# Altium project 110-0002.PrjPcb
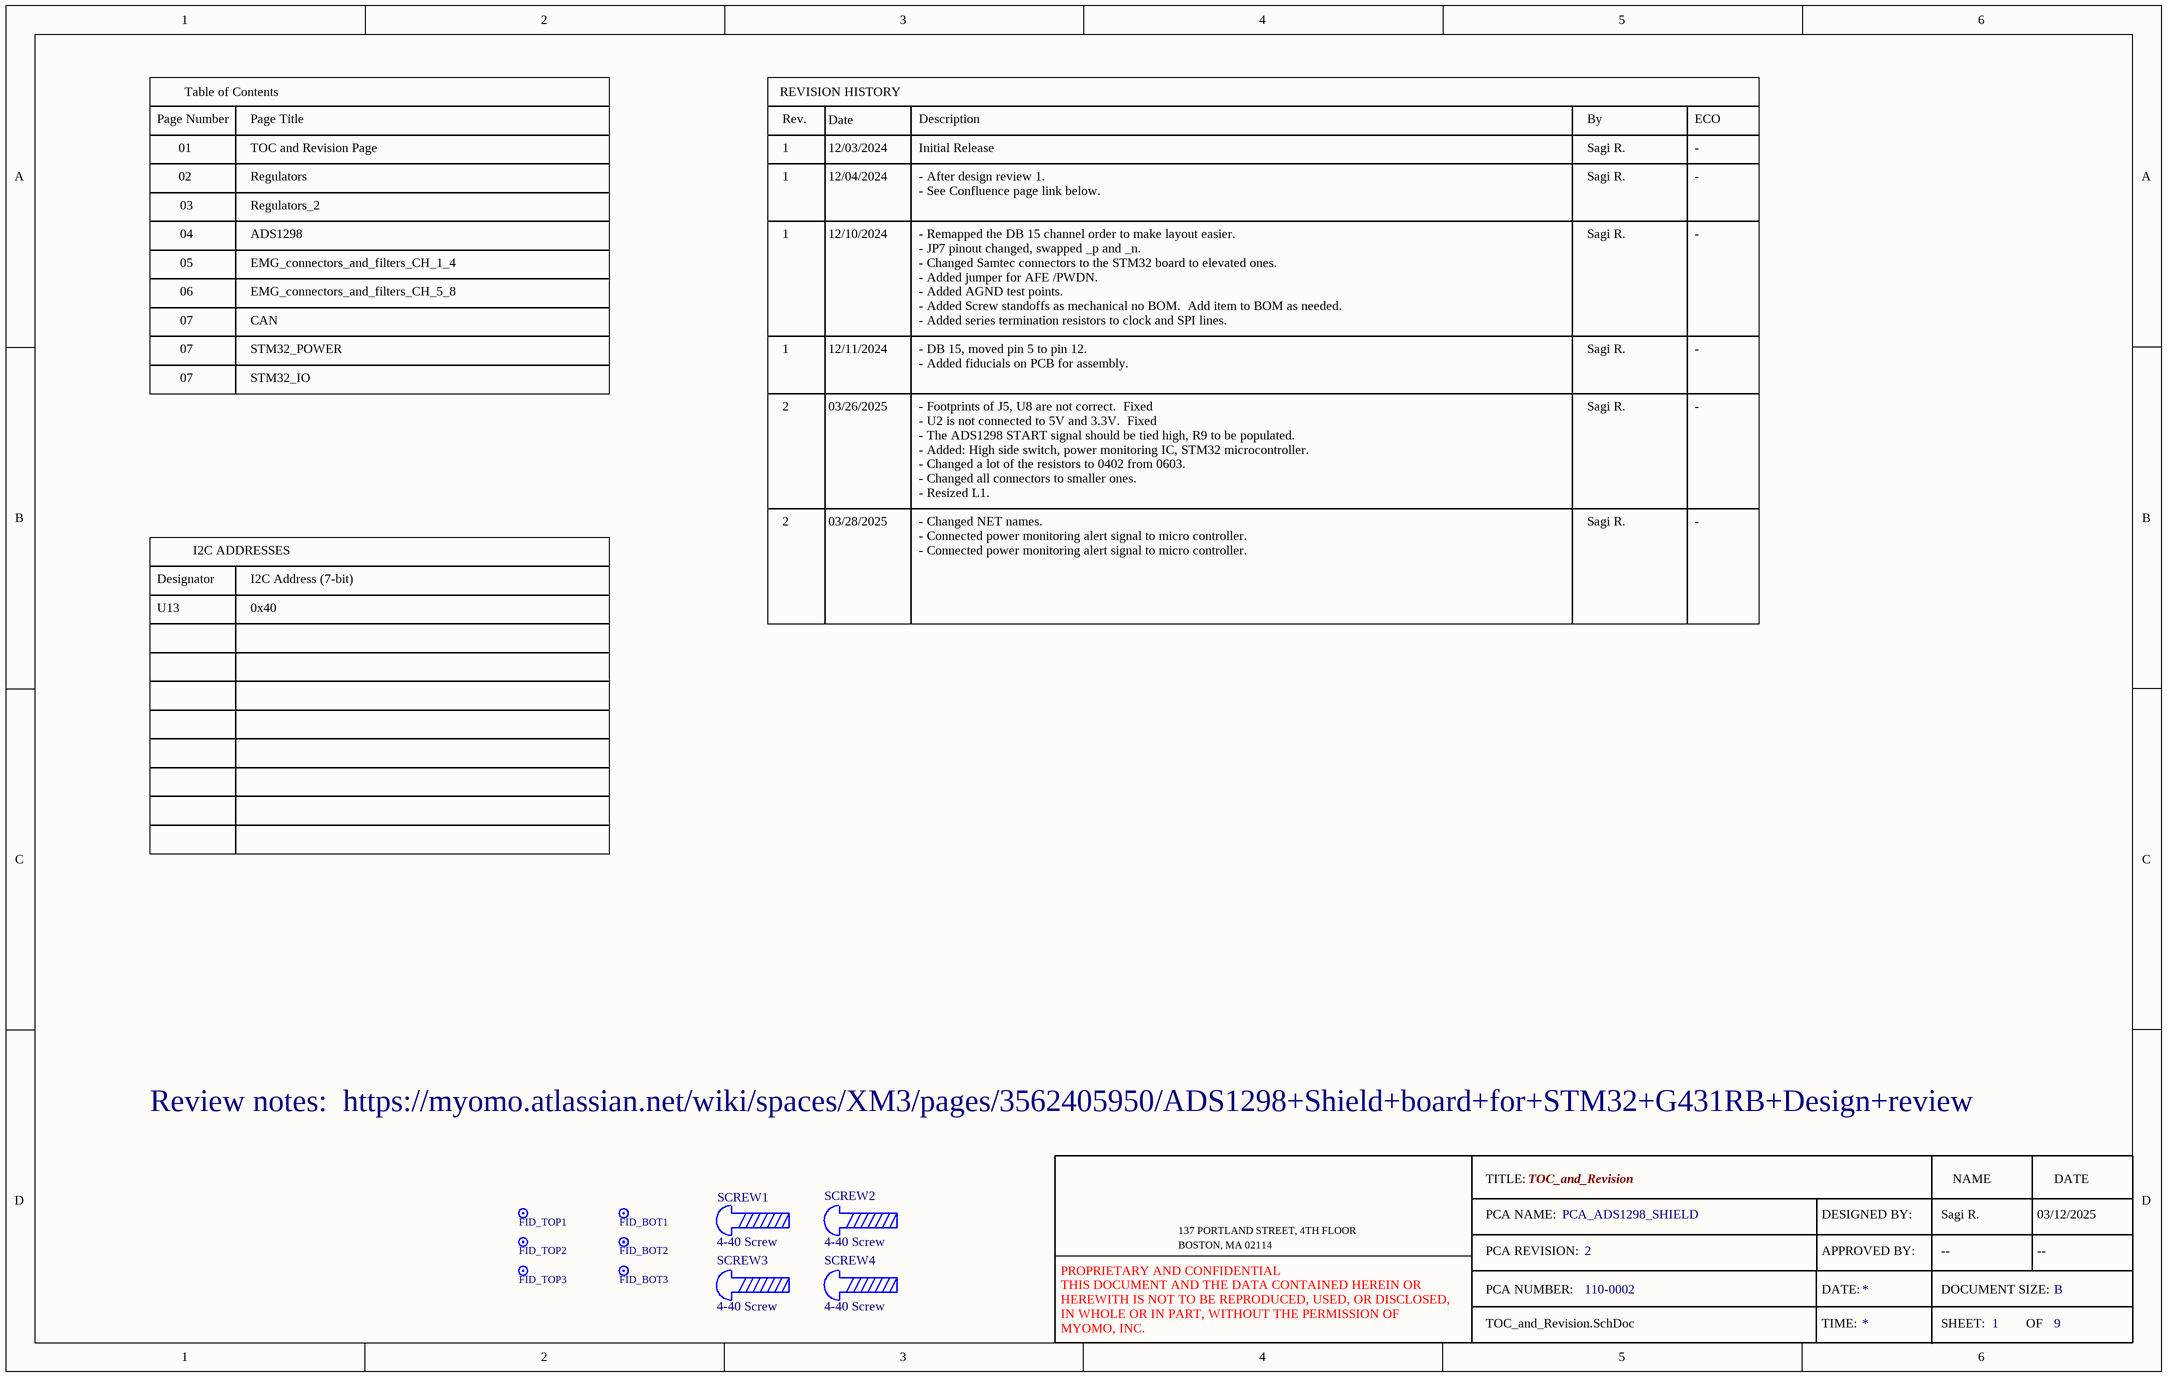
[diagram p0: TOC_and_Revision.SchDoc]
Address1: 45 Blue Sky Dr, Suite 101; Address2: Burlington, MA 01803-2778; Address3: USA; ApprovedBy: --; ApprovedDate: --; DesignDate: 03/12/2025; Engineer: Sagi R.; Organization: Myomo; PCA_Name: PCA_ADS1298_SHIELD; PCA_Number: 110-0002; PCA_Revision: 2; PCB_Name: PCB_ADS1298_SHIELD; PCB_Number: 100-0002; PCB_Revision: 2; PCBApprovedBy: --; PCBApprovedDate: --; SheetTotal: 9
9 sheets, 398 parts. Net scope: global (net labels, ports and power ports of the same name join across sheets).
Board file: 100-0002.PcbDoc
Sheets:
  TOC_and_Revision.SchDoc
  Regulators.SchDoc
  Regulators_2.SchDoc
  ADS1298.SchDoc
  EMG_connectors_and_filters_CH_1_4.SchDoc
  EMG_connectors_and_filters_CH_5_8.SchDoc
  CAN.SchDoc
  STM32_POWER.SchDoc
  STM32_IO.SchDoc

## Sheet TOC_and_Revision.SchDoc: TOC_and_Revision
size B; Organization: Myomo; Address1: 137 PORTLAND STREET, 4TH FLOOR; Address2: BOSTON, MA 02114; Address3: USA; SheetNumber: 1

### Parts
FID_BOT1  FID_BOT  [Fiducial_Bot]  (value not drawn)  (no BOM)
FID_BOT2  FID_BOT  [Fiducial_Bot]  (value not drawn)  (no BOM)
FID_BOT3  FID_BOT  [Fiducial_Bot]  (value not drawn)  (no BOM)
FID_TOP1  FID_TOP  [Fiducial_Top]  (value not drawn)  (no BOM)
FID_TOP2  FID_TOP  [Fiducial_Top]  (value not drawn)  (no BOM)
FID_TOP3  FID_TOP  [Fiducial_Top]  (value not drawn)  (no BOM)
SCREW1  4-40 Screw  [SCREW_4-40_STANDOFF]  (no BOM)
SCREW2  4-40 Screw  [SCREW_4-40_STANDOFF]  (no BOM)
SCREW3  4-40 Screw  [SCREW_4-40_STANDOFF]  (no BOM)
SCREW4  4-40 Screw  [SCREW_4-40_STANDOFF]  (no BOM)

### Notes on the sheet
- Table of Contents
- REVISION HISTORY
- Page Number
- 01
- Page Title
- TOC and Revision Page
- Rev.
- 1
- Date
- 12/03/2024
- Description
- Initial Release
- By
- Sagi R.
- ECO
- -
- 02
- 03
- 04
- Regulators
- ADS1298
- Regulators_2
- 12/04/2024
- 12/10/2024
- - After design review 1.
- - See Confluence page link below.
- - Remapped the DB 15 channel order to make layout easier.
- - JP7 pinout changed, swapped _p and _n.
- 05
- 06
- EMG_connectors_and_filters_CH_1_4
- EMG_connectors_and_filters_CH_5_8
- - Changed Samtec connectors to the STM32 board to elevated ones.
- - Added jumper for AFE /PWDN.
- - Added AGND test points.
- - Added Screw standoffs as mechanical no BOM.  Add item to BOM as needed.
- 07
- CAN
- STM32_IO
- STM32_POWER
- 12/11/2024
- - Added series termination resistors to clock and SPI lines.
- - DB 15, moved pin 5 to pin 12.
- - Added fiducials on PCB for assembly.
- 2
- 03/26/2025
- - Footprints of J5, U8 are not correct.  Fixed
- - U2 is not connected to 5V and 3.3V.  Fixed
- - The ADS1298 START signal should be tied high, R9 to be populated.
- - Added: High side switch, power monitoring IC, STM32 microcontroller.
- 03/28/2025
- - Changed a lot of the resistors to 0402 from 0603.
- - Changed all connectors to smaller ones.
- - Resized L1.
- - Changed NET names.
- - Connected power monitoring alert signal to micro controller.
- Designator
- I2C ADDRESSES
- I2C Address (7-bit)
- U13
- 0x40
- Review notes:  https://myomo.atlassian.net/wiki/spaces/XM3/pages/3562405950/ADS1298+Shield+board+for+STM32+G431RB+Design+review
- TITLE:
- NAME
- DATE
- PCA REVISION:
- PCA NAME:
- APPROVED BY:
- DESIGNED BY:
- PCA NUMBER:
- DATE:
- TIME:
- DOCUMENT SIZE:
- SHEET:
- OF
- B
- PROPRIETARY AND CONFIDENTIAL
  THIS DOCUMENT AND THE DATA CONTAINED HEREIN OR HEREWITH IS NOT TO BE REPRODUCED, USED, OR DISCLOSED, IN WHOLE OR IN PART, WITHOUT THE PERMISSION OF
  MYOMO, INC.

### Library data of the parts
FID_BOT1-FID_BOT3 = FID_BOT: Fiducial
FID_TOP1-FID_TOP3 = FID_TOP: Fiducial
SCREW1-SCREW4 = SCREW_4-40_STANDOFF: 4-40 standoff; MFG: none; MFGPN: 4-40 Screw

## Sheet Regulators.SchDoc: Regulators
size B; Organization: Myomo; Address1: 137 PORTLAND STREET, 4TH FLOOR; Address2: BOSTON, MA 02114; Address3: USA; SheetNumber: 2
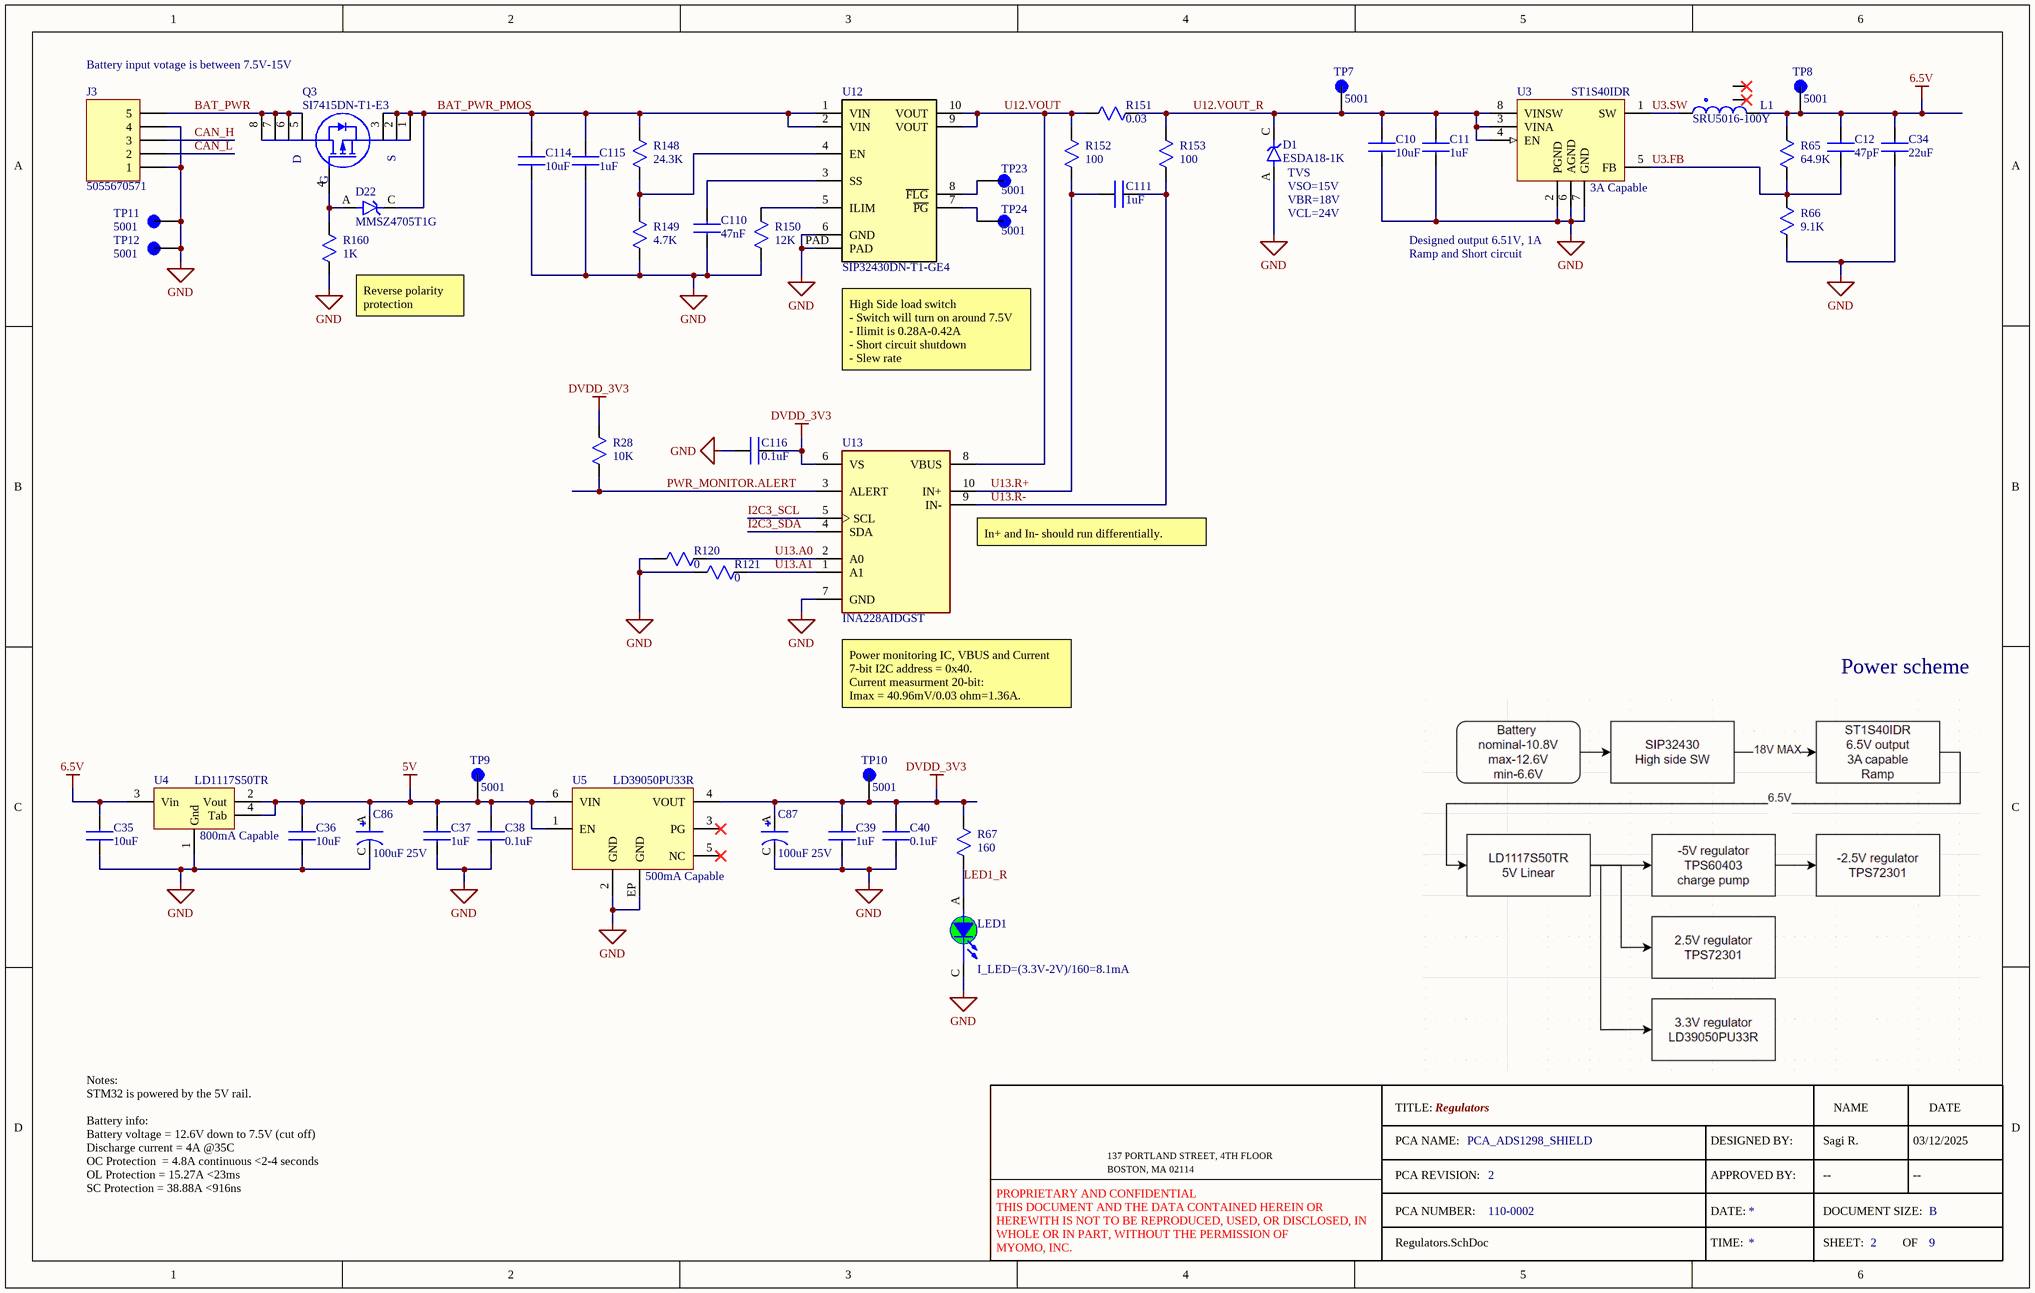
[diagram p1: Regulators.SchDoc]

### Parts
C10  10uF  [1210]
C11  1uF  [0603]
C12  47pF  [0603]
C34  22uF  [1210]
C35  10uF  [1210]
C36  10uF  [1210]
C37  1uF  [0603]
C38  0.1uF  [0402]
C39  1uF  [0603]
C40  0.1uF  [0402]
C86  100uF 25V  [C_2917_TANT_100uF_25V]
C87  100uF 25V  [C_2917_TANT_100uF_25V]
C110  47nF  [0402]
C111  1uF  [0603]
C114  10uF  [1210]
C115  1uF  [0603]
C116  0.1uF  [0402]
D1  ESDA18-1K  [D_TVS_18V_400W]
D22  MMSZ4705T1G  [D_ZENER_18V_500mW]
J3  5055670571  [J_MOLEX_5055670571]
L1  SRU5016-100Y  [L_10UH_84m_1A]
LED1  D_LED_GREEN_LTST  [D_LED_GREEN_LTST]  (value not drawn)
Q3  SI7415DN-T1-E3  [Q_PMOSFET_SI7415DN-T1-E3]
R28  10K  [0402]
R65  64.9K  [0603]
R66  9.1K  [0603]
R67  160  [0603]
R120  0  [0402]
R121  0  [0402]
R148  24.3K  [0402]
R149  4.7K  [0402]
R150  12K  [0402]
R151  0.03  [1206]
R152  100  [0402]
R153  100  [0402]
R160  1K  [0603]
TP7  5001  [TP_CLIP_BLK_5001]
TP8  5001  [TP_CLIP_BLK_5001]
TP9  5001  [TP_CLIP_BLK_5001]
TP10  5001  [TP_CLIP_BLK_5001]
TP11  5001  [TP_CLIP_BLK_5001]
TP12  5001  [TP_CLIP_BLK_5001]
TP23  5001  [TP_CLIP_BLK_5001]
TP24  5001  [TP_CLIP_BLK_5001]
U3  ST1S40IDR  [U_ST1S40IDR]
U4  LD1117S50TR  [U_LD1117S50TR]
U5  LD39050PU33R  [U_LD39050PU33R]
U12  SIP32430DN-T1-GE4  [U_SIP32430DN-T1-GE4]
U13  INA228AIDGST  [U_INA228AIDGS]

### Nets
5V: C36.1 C37.1 C38.1 C86.A TP9.TP U4.2(Vout) U4.4(Tab) U5.1(EN) U5.6(VIN)
6.5V: C12.1 C34.1 C35.1 L1.2 R65.1 TP8.TP U4.3(Vin)
DVDD_3V3: C39.1 C40.1 C87.A C116.2 R28.1 R67.1 TP10.TP U5.4(VOUT) U13.6(VS)
GND: C10.2 C11.2 C34.2 C35.2 C36.2 C37.2 C38.2 C39.2 C40.2 C86.C C87.C C110.2 C114.2 C115.2 C116.1 D1.A J3.1 J3.4 LED1.C(CATHODE) R66.2 R120.1 R121.1 R149.2 R150.2 R160.2 TP11.TP TP12.TP U3.2(PGND) U3.6(AGND) U3.7(GND) U4.1(Gnd) U5.2(GND) U5.EP(GND) U12.6(GND) U12.PAD U13.7(GND)
BAT_PWR: J3.5 Q3.5(D) Q3.6(D) Q3.7(D) Q3.8(D)
BAT_PWR_PMOS: C114.1 C115.1 D22.C Q3.1(S) Q3.2(S) Q3.3(S) R148.1 U12.1(VIN) U12.2(VIN)
CAN_H: J3.3
CAN_L: J3.2
I2C3_SCL: U13.5(SCL)
I2C3_SDA: U13.4(SDA)
LED1_R: LED1.A(ANODE) R67.2
PWR_MONITOR.ALERT: R28.2 U13.3(ALERT)
U3.FB: C12.2 R65.2 R66.1 U3.5(FB)
U3.SW: L1.1 U3.1(SW)
U12.VOUT: R151.1 R152.1 U12.9(VOUT) U12.10(VOUT) U13.8(VBUS)
U12.VOUT_R: C10.1 C11.1 D1.C R151.2 R153.1 TP7.TP U3.3(VINA) U3.4(EN) U3.8(VINSW)
U13.A0: R120.2 U13.2(A0)
U13.A1: R121.2 U13.1(A1)
U13.R+: C111.1 R152.2 U13.10(IN+)
U13.R-: C111.2 R153.2 U13.9(IN-)
NetC110_1: C110.1 U12.3(SS)
NetD22_A: D22.A Q3.4(G) R160.1
NetR148_2: R148.2 R149.1 U12.4(EN)
NetR150_1: R150.1 U12.5(ILIM)
NetTP23_TP: TP23.TP U12.8(~{FLG})
NetTP24_TP: TP24.TP U12.7(~{PG})

Not connected (* = marked no-connect by the designer): L1 MH1* MH2*; U5 3(PG)* 5(NC)*

### Notes on the sheet
- (near J3) Battery input votage is between 7.5V-15V
- (near D1) VBR=18V
- (near D1) VSO=15V
- (near D1) VCL=24V
- (near D1) TVS
- (near U3) 3A Capable
- Designed output 6.51V, 1A
- Ramp and Short circuit
- (near R160) Reverse polarity protection
- (near U12) High Side load switch
  - Switch will turn on around 7.5V
  - Ilimit is 0.28A-0.42A
  - Short circuit shutdown
  - Slew rate
- (near U13) In+ and In- should run differentially.
- (near U13) Power monitoring IC, VBUS and Current
  7-bit I2C address = 0x40.
  Current measurment 20-bit:
  Imax = 40.96mV/0.03 ohm=1.36A.
- Power scheme
- (near U4) 800mA Capable
- (near U5) 500mA Capable
- (near LED1) I_LED=(3.3V-2V)/160=8.1mA
- Notes:
  STM32 is powered by the 5V rail.
  Battery info:
  Battery voltage = 12.6V down to 7.5V (cut off)
  Discharge current = 4A @35C
  OC Protection  = 4.8A continuous <2-4 seconds
  OL Protection = 15.27A <23ms
  SC Protection = 38.88A <916ns
- TITLE:
- NAME
- DATE
- PCA REVISION:
- PCA NAME:
- APPROVED BY:
- DESIGNED BY:
- PCA NUMBER:
- DATE:
- TIME:
- DOCUMENT SIZE:
- SHEET:
- OF
- B
- PROPRIETARY AND CONFIDENTIAL
  THIS DOCUMENT AND THE DATA CONTAINED HEREIN OR HEREWITH IS NOT TO BE REPRODUCED, USED, OR DISCLOSED, IN WHOLE OR IN PART, WITHOUT THE PERMISSION OF
  MYOMO, INC.

### Library data of the parts
C10 C35 C36 C114 = C_1210_CER_10uF_25V_X7R: CAP CER 10UF 25V X7R 1210; MFG: SUMSUNG; MFGPN: CL32B106KAJNNNE; Myomo PN: 201-0004
C11 C37 C39 C111 C115 = C_0603_CER_1uF_50V_X7R: CAP CER 1UF 50V X7R 0603; MFG: YAGEO; MFGPN: CC0603KRX7R9BB105; Myomo PN: 201-0006
C12 = C_0603_CER_47pF_100V_COG: CAP CER 47PF 100V C0G/NP0 0603; MFG: KEMET; MFGPN: C0603C470J1GACTU; Myomo PN: 201-0011
C34 = C_1210_CER_22uF_25V_X7R: CAP CER 22UF 25V X7R 1210; MFG: SUMSUNG; MFGPN: CL32B226KAJNFNE; Myomo PN: 201-0007
C38 C40 C116 = C_0402_CER_0.1uF_50V_X7R: CAP CER 0.1UF 50V X7R 0402; MFG: Samsung; MFGPN: CL05B104KB54PNC; Myomo PN: 201-0017
C86 C87 = C_2917_TANT_100uF_25V: CAP TANT POLY 100UF 25V 2917; MFG: AVX Corporation; MFGPN: TCJD107M025R0070; Myomo PN: 201-0014
C110 = C_0402_CER_47nF_50V_X7R: CAP CER 47nF 50V X7R 0402; MFG: TDK; MFGPN: CGA2B3X7R1H473K050BB; Myomo PN: 201-0018
D1 = D_TVS_18V_400W: TVS DIODE 15VWM 34VC SOD523; MFG: STMicroelectronics; Myomo PN: 203-0003; MFGPN: ESDA18-1K
D22 = D_ZENER_18V_500mW: DIODE ZENER 18V 500MW SOD123; MFG: Onsemi; Myomo PN: 203-0008; MFGPN: MMSZ4705T1G
J3 = J_MOLEX_5055670571: CONN HEADER SMD R/A 5POS 1.25MM; MFG: Molex; Myomo PN: 211-0012; MFGPN: 5055670571; ComponentLink1Description: New link; ComponentLink1URL: *
L1 = L_10UH_84m_1A: FIXED IND 10UH 1A 84 MOHM SMD; MFG: Bourns Inc.; Myomo PN: 202-0003; MFGPN: SRU5016-100Y
LED1 = D_LED_GREEN_LTST: LED GREEN CLEAR 0603 SMD; Myomo PN: 203-0004; MFG: Lite-On Inc.; MFGPN: LTST-C191KGKT; Supplier 1: Digi-Key; Supplier Part Number 1: 160-1446-1-ND
Q3 = Q_PMOSFET_SI7415DN-T1-E3: MOSFET P-CH 60V 3.6A PPAK1212-8; MFG: Vishay; Myomo PN: 208-0002; Supplier 1: Digi-Key; MFGPN: SI7415DN-T1-E3; Supplier Part Number 1: MMUN2211LT1GOSCT-ND
R28 = R_0402_10K_1%_1/10W: RES SMD 10K OHM 1% 1/10W 0402; MFG: Panasonic; MFGPN: ERJ-2RKF1002X; Myomo PN: 200-0021
R65 = R_0603_64.9K_1%_1/10W: RES 64.9K OHM 1% 1/10W 0603; MFG: YAGEO; MFGPN: RC0603FR-0764K9L; Myomo PN: 200-0011
R66 = R_0603_9.1K_1%_1/10W: RES 9.1K OHM 1% 1/10W 0603; MFG: YAGEO; MFGPN: RC0603FR-079K1L; Myomo PN: 200-0010
R67 = R_0603_160_1%_1/10W: RES 160 OHM 1% 1/10W 0603; MFG: YAGEO; MFGPN: RC0603FR-07160RL; Myomo PN: 200-0012
R120 R121 = R_0402_0: RES 0 OHM JUMPER 1/10W 0402; MFG: YAGEO; MFGPN: RC0402FR-070RL; Myomo PN: 200-0018
R148 = R_0402_24.3K_1%_1/10W: RES SMD 24.3K OHM 1% 1/10W 0402; MFG: Panasonic; MFGPN: ERJ-2RKF2432X; Myomo PN: 200-0023
R149 = R_0402_4.7K_1%_1/10W: RES SMD 4.7K OHM 1% 1/10W 0402; MFG: Panasonic; MFGPN: ERJ-2RKF4701X; Myomo PN: 200-0022
R150 = R_0402_12K_1%_1/10W: RES SMD 12K OHM 1% 1/10W 0402; MFG: Panasonic; MFGPN: ERJ-2RKF1202X; Myomo PN: 200-0021
R151 = R_1206_0.03_0.5%_1W: RES 0.03 OHM 0.5% 1W 1206; MFG: Vishay; MFGPN: WSLP1206R0300DEA; Myomo PN: 200-0025
R152 R153 = R_0402_100_1%_1/10W: RES SMD 100 OHM 1% 1/10W 0402; MFG: Panasonic; MFGPN: ERJ-2RKF1000X; Myomo PN: 200-0019
R160 = R_0603_1K_1%_1/10W: RES 1K OHM 1% 1/10W 0603; MFG: YAGEO; MFGPN: RC0603FR-071KL; Myomo PN: 200-0029
TP7-TP12 TP23 TP24 = TP_CLIP_BLK_5001: PC TEST POINT MINIATURE BLACK; MFG: Keystone Electronics; Myomo PN: 213-0001; MFGPN: 5001
U3 = U_ST1S40IDR: IC REG BUCK ADJ 3A 8SOIC; MFG: STMicroelectronics; Myomo PN: 204-0004; MFGPN: ST1S40IDR; Supplier 1: Digikey; Supplier Part Number 1: 497-12968-1-ND
U4 = U_LD1117S50TR: IC REG LINEAR 5V 800MA SOT223; MFG: STMICROELECTRONICS; Myomo PN: 204-0006; MFGPN: LD1117S50TR; ComponentLink1Description: Datasheet; ComponentLink1URL: http://tunmcdsvn.tun.st.com/Component_Datasheet_Library/Trunk/IC/STM_LDO_LD1117
U5 = U_LD39050PU33R: IC REG LINEAR 3.3V 500MA 6DFN; MFG: STMICROELECTRONICS; Myomo PN: 204-0005; MFGPN: LD39050PU33R; ComponentLink1Description: Datasheet; ComponentLink1URL: http://tunmcdsvn.tun.st.com/Component_Datasheet_Library/Trunk/IC/STM_LDO_LD1117
U12 = U_SIP32430DN-T1-GE4: HIGH SIDE SWITCH - IC PWR SWITCH P-CHAN 1:1 10DFN; MFG: Vishay; Myomo PN: 204-0013; MFGPN: SIP32430DN-T1-GE4
U13 = U_INA228AIDGS: IC REG BUCK ADJ 3A 8SOIC; MFG: TI; Myomo PN: 204-0014; MFGPN: INA228AIDGST; Supplier 1: Digikey; Supplier Part Number 1: 296-INA228AIDGSTDKR-ND

## Sheet Regulators_2.SchDoc: Regulators_2
size B; Organization: Myomo; Address1: 137 PORTLAND STREET, 4TH FLOOR; Address2: BOSTON, MA 02114; Address3: USA; SheetNumber: 3
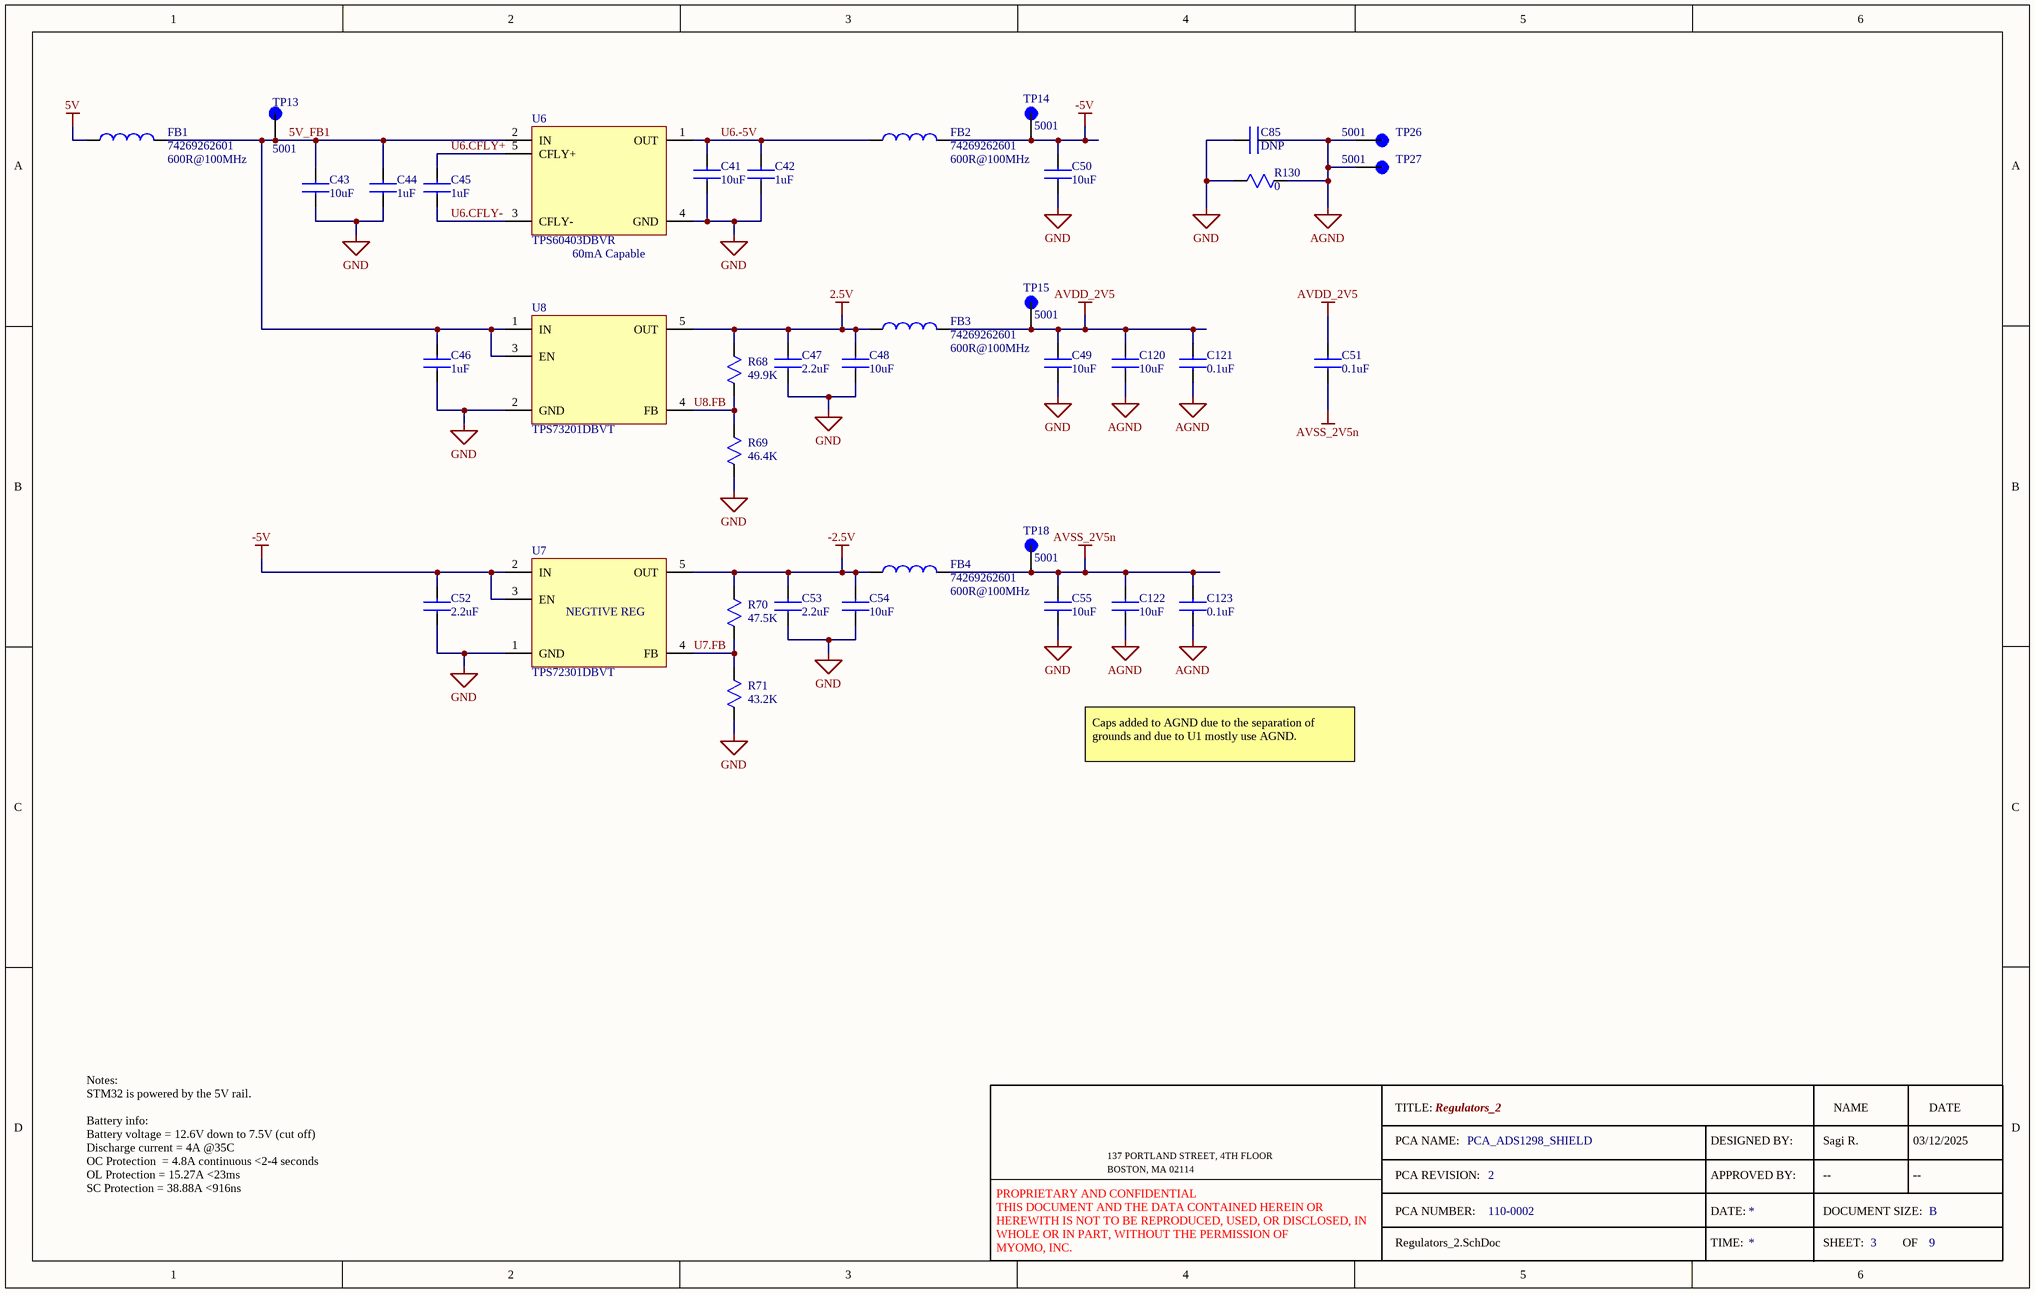
[diagram p2: Regulators_2.SchDoc]

### Parts
C41  10uF  [1210]
C42  1uF  [0603]
C43  10uF  [1210]
C44  1uF  [0603]
C45  1uF  [0603]
C46  1uF  [0603]
C47  2.2uF  [0603]
C48  10uF  [1210]
C49  10uF  [1210]
C50  10uF  [1210]
C51  0.1uF  [0603]
C52  2.2uF  [0603]
C53  2.2uF  [0603]
C54  10uF  [1210]
C55  10uF  [1210]
C85  DNP  [0603]  (no BOM)
C120  10uF  [1210]
C121  0.1uF  [0603]
C122  10uF  [1210]
C123  0.1uF  [0603]
FB1  74269262601  [0603]
FB2  74269262601  [0603]
FB3  74269262601  [0603]
FB4  74269262601  [0603]
R68  49.9K  [0603]
R69  46.4K  [0603]
R70  47.5K  [0603]
R71  43.2K  [0603]
R130  0  [0603]
TP13  5001  [TP_CLIP_BLK_5001]
TP14  5001  [TP_CLIP_BLK_5001]
TP15  5001  [TP_CLIP_BLK_5001]
TP18  5001  [TP_CLIP_BLK_5001]
TP26  5001  [TP_CLIP_BLK_5001]
TP27  5001  [TP_CLIP_BLK_5001]
U6  TPS60403DBVR  [U_TPS60403DBVR]
U7  TPS72301DBVT  [U_TPS72301DBVT_NEG]
U8  TPS73201DBVT  [U_TPS73201DBVT]

### Nets
2.5V: C47.1 C48.1 FB3.1 R68.1 U8.5(OUT)
5V: FB1.1
-2.5V: C53.1 C54.1 FB4.1 R70.1 U7.5(OUT)
-5V: C50.1 C52.1 FB2.2 TP14.TP U7.2(IN) U7.3(EN)
AGND: C85.2 C120.2 C121.2 C122.2 C123.2 R130.2 TP26.TP TP27.TP
AVDD_2V5: C49.1 C51.1 C120.1 C121.1 FB3.2 TP15.TP
AVSS_2V5n: C51.2 C55.1 C122.1 C123.1 FB4.2 TP18.TP
GND: C41.2 C42.2 C43.2 C44.2 C46.2 C47.2 C48.2 C49.2 C50.2 C52.2 C53.2 C54.2 C55.2 C85.1 R69.2 R71.2 R130.1 U6.4(GND) U7.1(GND) U8.2(GND)
5V_FB1: C43.1 C44.1 C46.1 FB1.2 TP13.TP U6.2(IN) U8.1(IN) U8.3(EN)
U6.-5V: C41.1 C42.1 FB2.1 U6.1(OUT)
U6.CFLY+: C45.1 U6.5(CFLY+)
U6.CFLY-: C45.2 U6.3(CFLY-)
U7.FB: R70.2 R71.1 U7.4(FB)
U8.FB: R68.2 R69.1 U8.4(FB)

### Notes on the sheet
- (near U6) 60mA Capable
- Caps added to AGND due to the separation of grounds and due to U1 mostly use AGND.
- Notes:
  STM32 is powered by the 5V rail.
  Battery info:
  Battery voltage = 12.6V down to 7.5V (cut off)
  Discharge current = 4A @35C
  OC Protection  = 4.8A continuous <2-4 seconds
  OL Protection = 15.27A <23ms
  SC Protection = 38.88A <916ns
- TITLE:
- NAME
- DATE
- PCA REVISION:
- PCA NAME:
- APPROVED BY:
- DESIGNED BY:
- PCA NUMBER:
- DATE:
- TIME:
- DOCUMENT SIZE:
- SHEET:
- OF
- B
- PROPRIETARY AND CONFIDENTIAL
  THIS DOCUMENT AND THE DATA CONTAINED HEREIN OR HEREWITH IS NOT TO BE REPRODUCED, USED, OR DISCLOSED, IN WHOLE OR IN PART, WITHOUT THE PERMISSION OF
  MYOMO, INC.
- (in symbol FB_0603 _600_100MHz_1.5A) 600R@100MHz
- (in symbol U_TPS72301DBVT_NEG) NEGTIVE REG

### Library data of the parts
C41 C43 C48-C50 C54 C55 C120 C122 = C_1210_CER_10uF_25V_X7R: as C10 on sheet Regulators
C42 C44-C46 = C_0603_CER_1uF_50V_X7R: as C11 on sheet Regulators
C47 C52 C53 = C_0603_CER_2.2uF_50V_X5R: CAP CER 2.2UF 50V X5R 0603; MFG: SAMSUNG; MFGPN: CL10A225KB8NNNC; Myomo PN: 201-0012
C51 C121 C123 = C_0603_CER_0.1uF_100V_X7R: CAP CER 0.1UF 100V X7R 0603; MFG: SAMSUNG; MFGPN: CL10B104KC8NNNC; Myomo PN: 201-0005
C85 = C_0603_DNP: CAP CER 0603 DNP
FB1-FB4 = FB_0603 _600_100MHz_1.5A: 600 Ohms @ 100 MHz 1 Power Line Ferrite Bead 0603 (1608 Metric) 1.5A 100mOhm; MFG: Wurth Elektronik; Myomo PN: 202-0001; MFGPN: 74269262601
R68 = R_0603_49.9K_1%_1/10W: RES 49.9K OHM 1% 1/10W 0603; MFG: YAGEO; MFGPN: RC0603FR-0749K9L; Myomo PN: 200-0009
R69 = R_0603_46.4K_1%_1/10W: RES 46.4K OHM 1% 1/10W 0603; MFG: YAGEO; MFGPN: RC0603FR-0746K4L; Myomo PN: 200-0013
R70 = R_0603_47.5K_1%_1/10W: RES 47.5K OHM 1% 1/10W 0603; MFG: YAGEO; MFGPN: RC0603FR-0747K5L; Myomo PN: 200-0014
R71 = R_0603_43.2K_1%_1/10W: RES 43.2K OHM 1% 1/10W 0603; MFG: YAGEO; MFGPN: RC0603FR-1343K2L; Myomo PN: 200-0015
R130 = R_0603_0: RES 0 OHM JUMPER 1/10W 0603; MFG: YAGEO; MFGPN: RC0603FR-070RL; Myomo PN: 200-0007
TP13-TP15 TP18 TP26 TP27 = TP_CLIP_BLK_5001: as TP7 on sheet Regulators; MFGPN: 5001
U6 = U_TPS60403DBVR: IC REG CHG PUMP INV 60MA SOT23-5; MFG: TI; Myomo PN: 204-0007; MFGPN: TPS60403DBVR
U7 = U_TPS72301DBVT_NEG: IC REG LIN NEG ADJ 200MA SOT23-5; MFG: TI; Myomo PN: 204-0008; MFGPN: TPS72301DBVT
U8 = U_TPS73201DBVT: IC REG LIN POS ADJ 250MA SOT23-5; MFG: TI; Myomo PN: 204-0009; MFGPN: TPS73201DBVT

## Sheet ADS1298.SchDoc: ADS1298
size B; Organization: Myomo; Address1: 137 PORTLAND STREET, 4TH FLOOR; Address2: BOSTON, MA 02114; Address3: USA; SheetNumber: 4
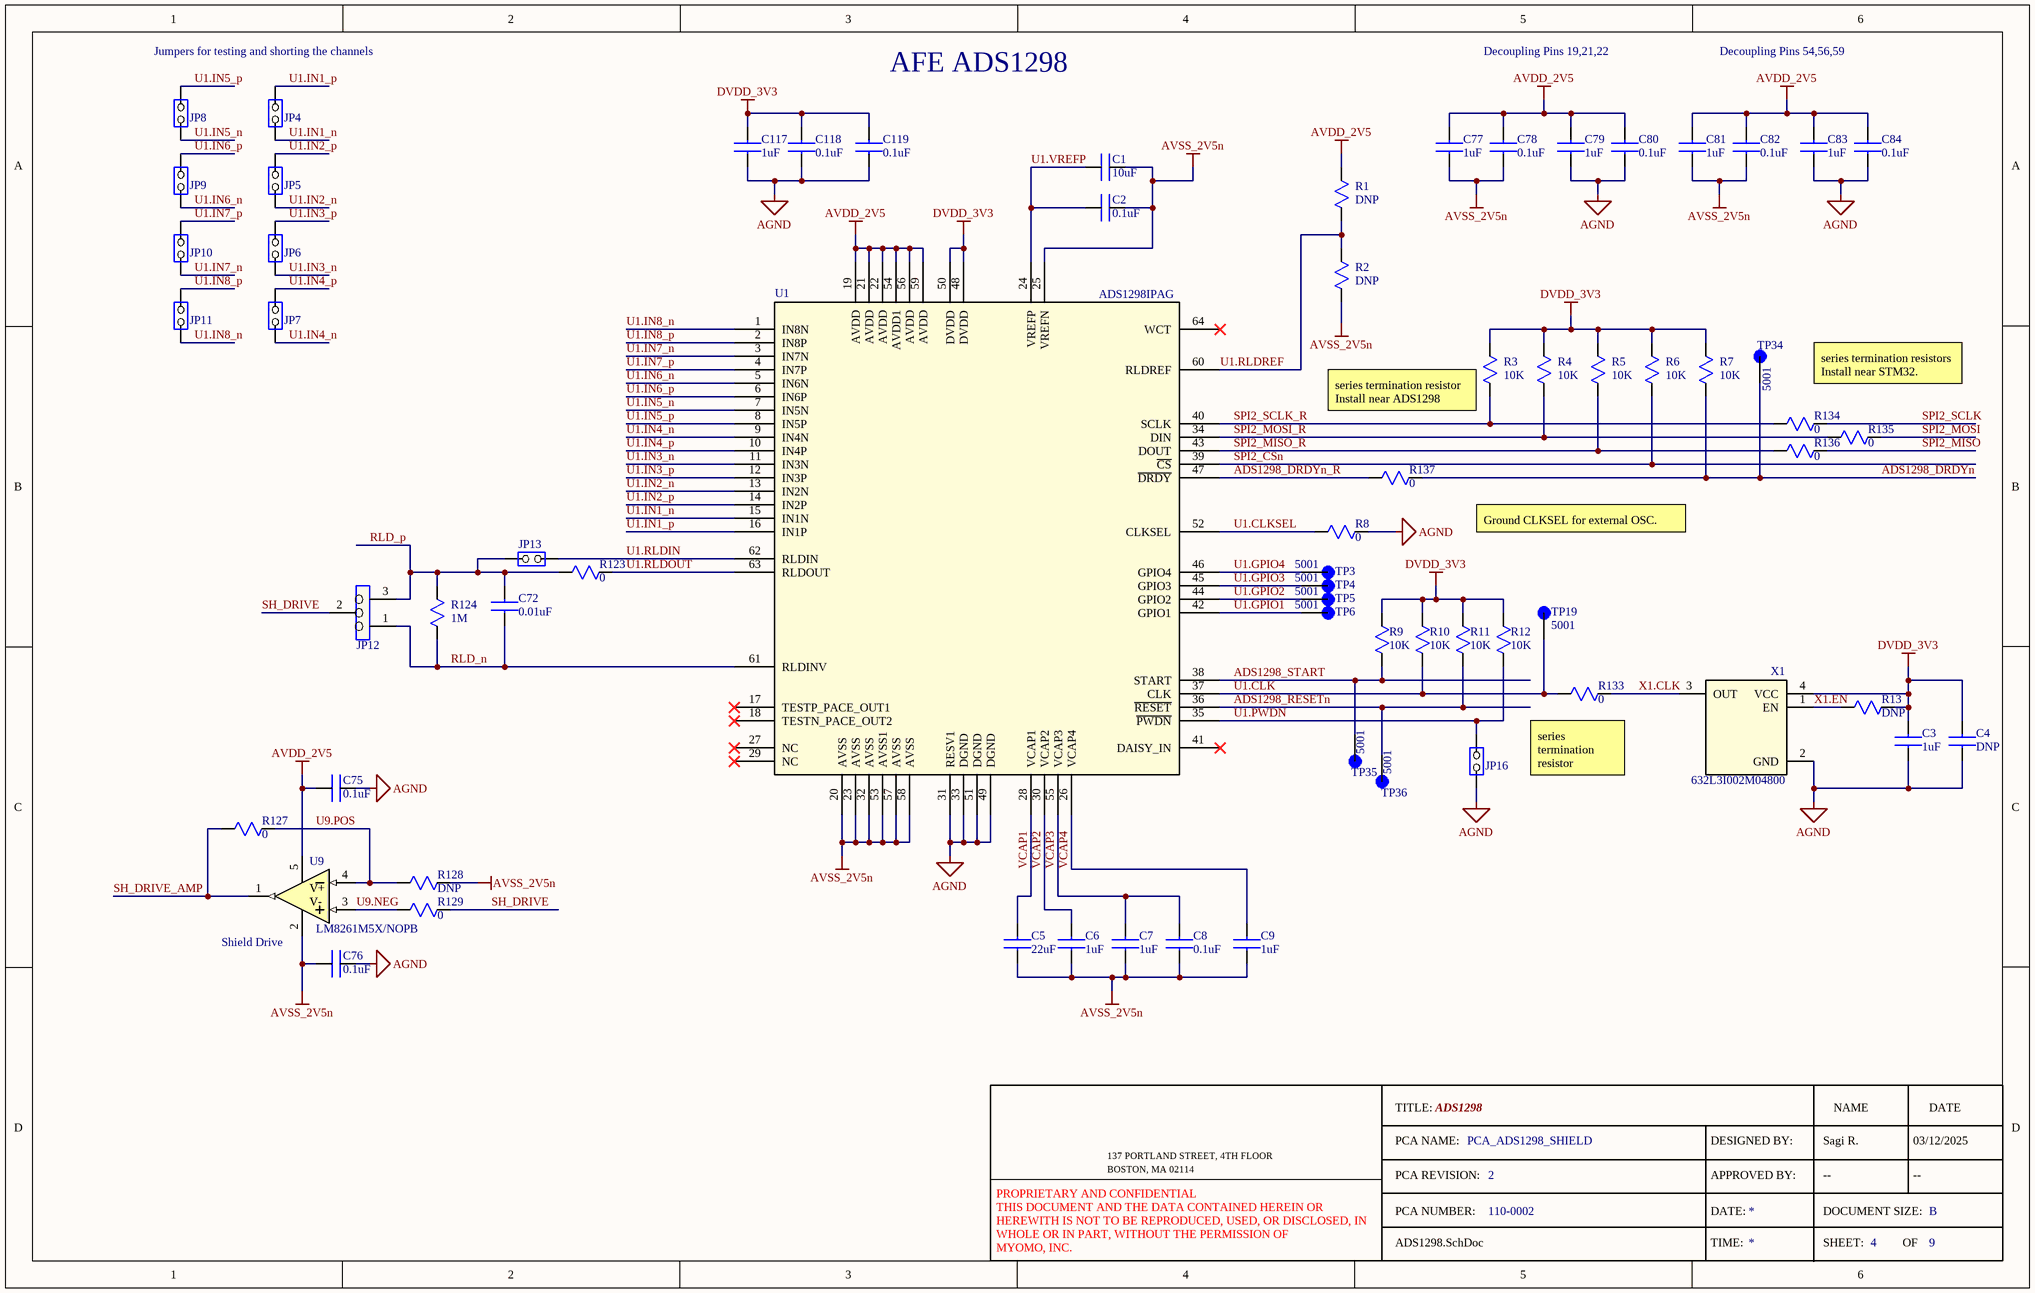
[diagram p3: ADS1298.SchDoc]

### Parts
C1  10uF  [1210]
C2  0.1uF  [0402]
C3  1uF  [0603]
C4  DNP  [0603]  (no BOM)
C5  22uF  [1210]
C6  1uF  [0603]
C7  1uF  [0603]
C8  0.1uF  [0402]
C9  1uF  [0603]
C72  0.01uF  [0603]
C75  0.1uF  [0402]
C76  0.1uF  [0402]
C77  1uF  [0603]
C78  0.1uF  [0402]
C79  1uF  [0603]
C80  0.1uF  [0402]
C81  1uF  [0603]
C82  0.1uF  [0402]
C83  1uF  [0603]
C84  0.1uF  [0402]
C117  1uF  [0603]
C118  0.1uF  [0402]
C119  0.1uF  [0402]
JP4  JP_1x2_TSW-102-07-F-S  [JP_1x2_TSW-102-07-F-S]  (value not drawn)
JP5  JP_1x2_TSW-102-07-F-S  [JP_1x2_TSW-102-07-F-S]  (value not drawn)
JP6  JP_1x2_TSW-102-07-F-S  [JP_1x2_TSW-102-07-F-S]  (value not drawn)
JP7  JP_1x2_TSW-102-07-F-S  [JP_1x2_TSW-102-07-F-S]  (value not drawn)
JP8  JP_1x2_TSW-102-07-F-S  [JP_1x2_TSW-102-07-F-S]  (value not drawn)
JP9  JP_1x2_TSW-102-07-F-S  [JP_1x2_TSW-102-07-F-S]  (value not drawn)
JP10  JP_1x2_TSW-102-07-F-S  [JP_1x2_TSW-102-07-F-S]  (value not drawn)
JP11  JP_1x2_TSW-102-07-F-S  [JP_1x2_TSW-102-07-F-S]  (value not drawn)
JP12  JP_1x3_TSW-103-07-F-S  [JP_1x3_TSW-103-07-F-S]  (value not drawn)
JP13  JP_1x2_TSW-102-07-F-S  [JP_1x2_TSW-102-07-F-S]  (value not drawn)
JP16  JP_1x2_TSW-102-07-F-S  [JP_1x2_TSW-102-07-F-S]  (value not drawn)
R1  DNP  [0402]  (no BOM)
R2  DNP  [0402]  (no BOM)
R3  10K  [0402]
R4  10K  [0402]
R5  10K  [0402]
R6  10K  [0402]
R7  10K  [0402]
R8  0  [0603]
R9  10K  [0402]
R10  10K  [0402]
R11  10K  [0402]
R12  10K  [0402]
R13  DNP  [0603]  (no BOM)
R123  0  [0603]
R124  1M  [0402]
R127  0  [0402]
R128  DNP  [0402]  (no BOM)
R129  0  [0402]
R133  0  [0603]
R134  0  [0402]
R135  0  [0402]
R136  0  [0402]
R137  0  [0603]
TP3  5001  [TP_CLIP_BLK_5001]
TP4  5001  [TP_CLIP_BLK_5001]
TP5  5001  [TP_CLIP_BLK_5001]
TP6  5001  [TP_CLIP_BLK_5001]
TP19  5001  [TP_CLIP_BLK_5001]
TP34  5001  [TP_CLIP_BLK_5001]
TP35  5001  [TP_CLIP_BLK_5001]
TP36  5001  [TP_CLIP_BLK_5001]
U1  ADS1298IPAG  [U_ADS1298IPAG]
U9  LM8261M5X/NOPB  [U_LM8261M5X/NOPB]
X1  632L3I002M04800  [XTAL_2.048MHZ_50PPM_3.3V]

### Nets
AGND: C3.2 C4.2 C75.2 C76.2 C79.2 C80.2 C83.2 C84.2 C117.2 C118.2 C119.2 JP16.1 R8.2 U1.31(RESV1) U1.33(DGND) U1.49(DGND) U1.51(DGND) X1.2(GND)
AVDD_2V5: C75.1 C77.1 C78.1 C79.1 C80.1 C81.1 C82.1 C83.1 C84.1 R1.1 U1.19(AVDD) U1.21(AVDD) U1.22(AVDD) U1.54(AVDD1) U1.56(AVDD) U1.59(AVDD) U9.5(V+)
AVSS_2V5n: C1.2 C2.2 C5.2 C6.2 C7.2 C8.2 C9.2 C76.1 C77.2 C78.2 C81.2 C82.2 R2.2 R128.2 U1.20(AVSS) U1.23(AVSS) U1.25(VREFN) U1.32(AVSS) U1.53(AVSS1) U1.57(AVSS) U1.58(AVSS) U9.2(V-)
DVDD_3V3: C3.1 C4.1 C117.1 C118.1 C119.1 R3.1 R4.1 R5.1 R6.1 R7.1 R9.1 R10.1 R11.1 R12.1 R13.2 U1.48(DVDD) U1.50(DVDD) X1.4(VCC)
ADS1298_DRDYn: R7.2 R137.2 TP34.TP
ADS1298_DRDYn_R: R137.1 U1.47(~{DRDY})
ADS1298_RESETn: R11.2 TP36.TP U1.36(~{RESET})
ADS1298_START: R9.2 TP35.TP U1.38(START)
RLD_n: C72.2 JP12.1 R124.2 U1.61(RLDINV)
RLD_p: C72.1 JP12.3 JP13.1 R123.1 R124.1
SH_DRIVE: JP12.2 R129.2
SH_DRIVE_AMP: R127.1 U9.1(OUT)
SPI2_CSn: R6.2 U1.39(~{CS})
SPI2_MISO: R136.2
SPI2_MISO_R: R5.2 R136.1 U1.43(DOUT)
SPI2_MOSI: R135.2
SPI2_MOSI_R: R4.2 R135.1 U1.34(DIN)
SPI2_SCLK: R134.2
SPI2_SCLK_R: R3.2 R134.1 U1.40(SCLK)
U1.CLK: R10.2 R133.1 TP19.TP U1.37(CLK)
U1.CLKSEL: R8.1 U1.52(CLKSEL)
U1.GPIO1: TP6.TP U1.42(GPIO1)
U1.GPIO2: TP5.TP U1.44(GPIO2)
U1.GPIO3: TP4.TP U1.45(GPIO3)
U1.GPIO4: TP3.TP U1.46(GPIO4)
U1.IN1_n: JP4.2 U1.15(IN1N)
U1.IN1_p: JP4.1 U1.16(IN1P)
U1.IN2_n: JP5.2 U1.13(IN2N)
U1.IN2_p: JP5.1 U1.14(IN2P)
U1.IN3_n: JP6.2 U1.11(IN3N)
U1.IN3_p: JP6.1 U1.12(IN3P)
U1.IN4_n: JP7.2 U1.9(IN4N)
U1.IN4_p: JP7.1 U1.10(IN4P)
U1.IN5_n: JP8.2 U1.7(IN5N)
U1.IN5_p: JP8.1 U1.8(IN5P)
U1.IN6_n: JP9.2 U1.5(IN6N)
U1.IN6_p: JP9.1 U1.6(IN6P)
U1.IN7_n: JP10.2 U1.3(IN7N)
U1.IN7_p: JP10.1 U1.4(IN7P)
U1.IN8_n: JP11.2 U1.1(IN8N)
U1.IN8_p: JP11.1 U1.2(IN8P)
U1.PWDN: JP16.2 R12.2 U1.35(~{PWDN})
U1.RLDIN: JP13.2 U1.62(RLDIN)
U1.RLDOUT: R123.2 U1.63(RLDOUT)
U1.RLDREF: R1.2 R2.1 U1.60(RLDREF)
U1.VREFP: C1.1 C2.1 U1.24(VREFP)
U9.NEG: R129.1 U9.3(IN+)
U9.POS: R127.2 R128.1 U9.4(IN-)
VCAP1: C5.1 U1.28(VCAP1)
VCAP2: C6.1 U1.30(VCAP2)
VCAP3: C7.1 C8.1 U1.55(VCAP3)
VCAP4: C9.1 U1.26(VCAP4)
X1.CLK: R133.2 X1.3(OUT)
X1.EN: R13.1 X1.1(EN)

Not connected (* = marked no-connect by the designer): U1 17(TESTP_PACE_OUT1)* 18(TESTN_PACE_OUT2)* 27(NC)* 29(NC)* 41(DAISY_IN)* 64(WCT)*

### Notes on the sheet
- Jumpers for testing and shorting the channels
- AFE ADS1298
- Decoupling Pins 19,21,22
- Decoupling Pins 54,56,59
- (near R3) series termination resistor
  Install near ADS1298
- series termination resistors
  Install near STM32.
- Ground CLKSEL for external OSC.
- (near R133) series termination resistor
- Shield Drive
- TITLE:
- NAME
- DATE
- PCA REVISION:
- PCA NAME:
- APPROVED BY:
- DESIGNED BY:
- PCA NUMBER:
- DATE:
- TIME:
- DOCUMENT SIZE:
- SHEET:
- OF
- B
- PROPRIETARY AND CONFIDENTIAL
  THIS DOCUMENT AND THE DATA CONTAINED HEREIN OR HEREWITH IS NOT TO BE REPRODUCED, USED, OR DISCLOSED, IN WHOLE OR IN PART, WITHOUT THE PERMISSION OF
  MYOMO, INC.

### Library data of the parts
C1 = C_1210_CER_10uF_25V_X7R: as C10 on sheet Regulators
C2 C8 C75 C76 C78 C80 C82 C84 C118 C119 = C_0402_CER_0.1uF_50V_X7R: as C38 on sheet Regulators
C3 C6 C7 C9 C77 C79 C81 C83 C117 = C_0603_CER_1uF_50V_X7R: as C11 on sheet Regulators
C4 = C_0603_DNP: CAP CER 0603 DNP
C5 = C_1210_CER_22uF_25V_X7R: as C34 on sheet Regulators
C72 = C_0603_CER_0.01uF_100V_X7R: CAP CER 10000PF 100V X7R 0603; MFG: SAMSUNG; MFGPN: CL10B103KC8WPJL; Myomo PN: 201-0013
JP4-JP11 JP13 JP16 = JP_1x2_TSW-102-07-F-S: CONN HEADER VERT 2POS 2.54MM; MFG: SAMTEC; Myomo PN: 214-0001; MFGPN: TSW-102-07-F-S
JP12 = JP_1x3_TSW-103-07-F-S: CONN HEADER VERT 2POS 2.54MM; MFG: SAMTEC; Myomo PN: 214-0002; MFGPN: TSW-103-07-F-S
R1 R2 R128 = R_0402_DNP: RES 0402 DNP
R3-R7 R9-R12 = R_0402_10K_1%_1/10W: as R28 on sheet Regulators
R8 R123 R133 R137 = R_0603_0: as R130 on sheet Regulators_2
R13 = R_0603_DNP: RES 0603 DNP
R124 = R_0402_1M_1%_1/10W: RES SMD 1M OHM 1% 1/10W 0402; MFG: Panasonic; MFGPN: ERJ-2RKF1004X; Myomo PN: 200-0028
R127 R129 R134-R136 = R_0402_0: as R120 on sheet Regulators
TP3-TP6 TP19 TP34-TP36 = TP_CLIP_BLK_5001: as TP7 on sheet Regulators; MFGPN: 5001
U1 = U_ADS1298IPAG: 8-Channel 24-bit ADC With Integrated ECG Front End; MFG: TI; Myomo PN: 204-0002; MFGPN: ADS1298IPAG; Supplier 1: Mouser; Supplier Part Number 1: 595-ADS1298IPAG
U9 = U_LM8261M5X/NOPB: IC OPAMP GP 1 CIRCUIT SOT23-5; MFG: Texas Instruments; Myomo PN: 204-0010; MFGPN: LM8261M5X/NOPB
X1 = XTAL_2.048MHZ_50PPM_3.3V: XTAL OSC XO 2.0480MHZ HCMOS SMD; MFG: CTS; Myomo PN: 205-0001; MFGPN: 632L3I002M04800; Supplier 1: Digikey; Supplier Part Number 1: CTX1438DKR-ND

## Sheet EMG_connectors_and_filters_CH_1_4.SchDoc: EMG_connectors_and_filters_CH_1_4
size B; Organization: Myomo; Address1: 137 PORTLAND STREET, 4TH FLOOR; Address2: BOSTON, MA 02114; Address3: USA; SheetNumber: 5
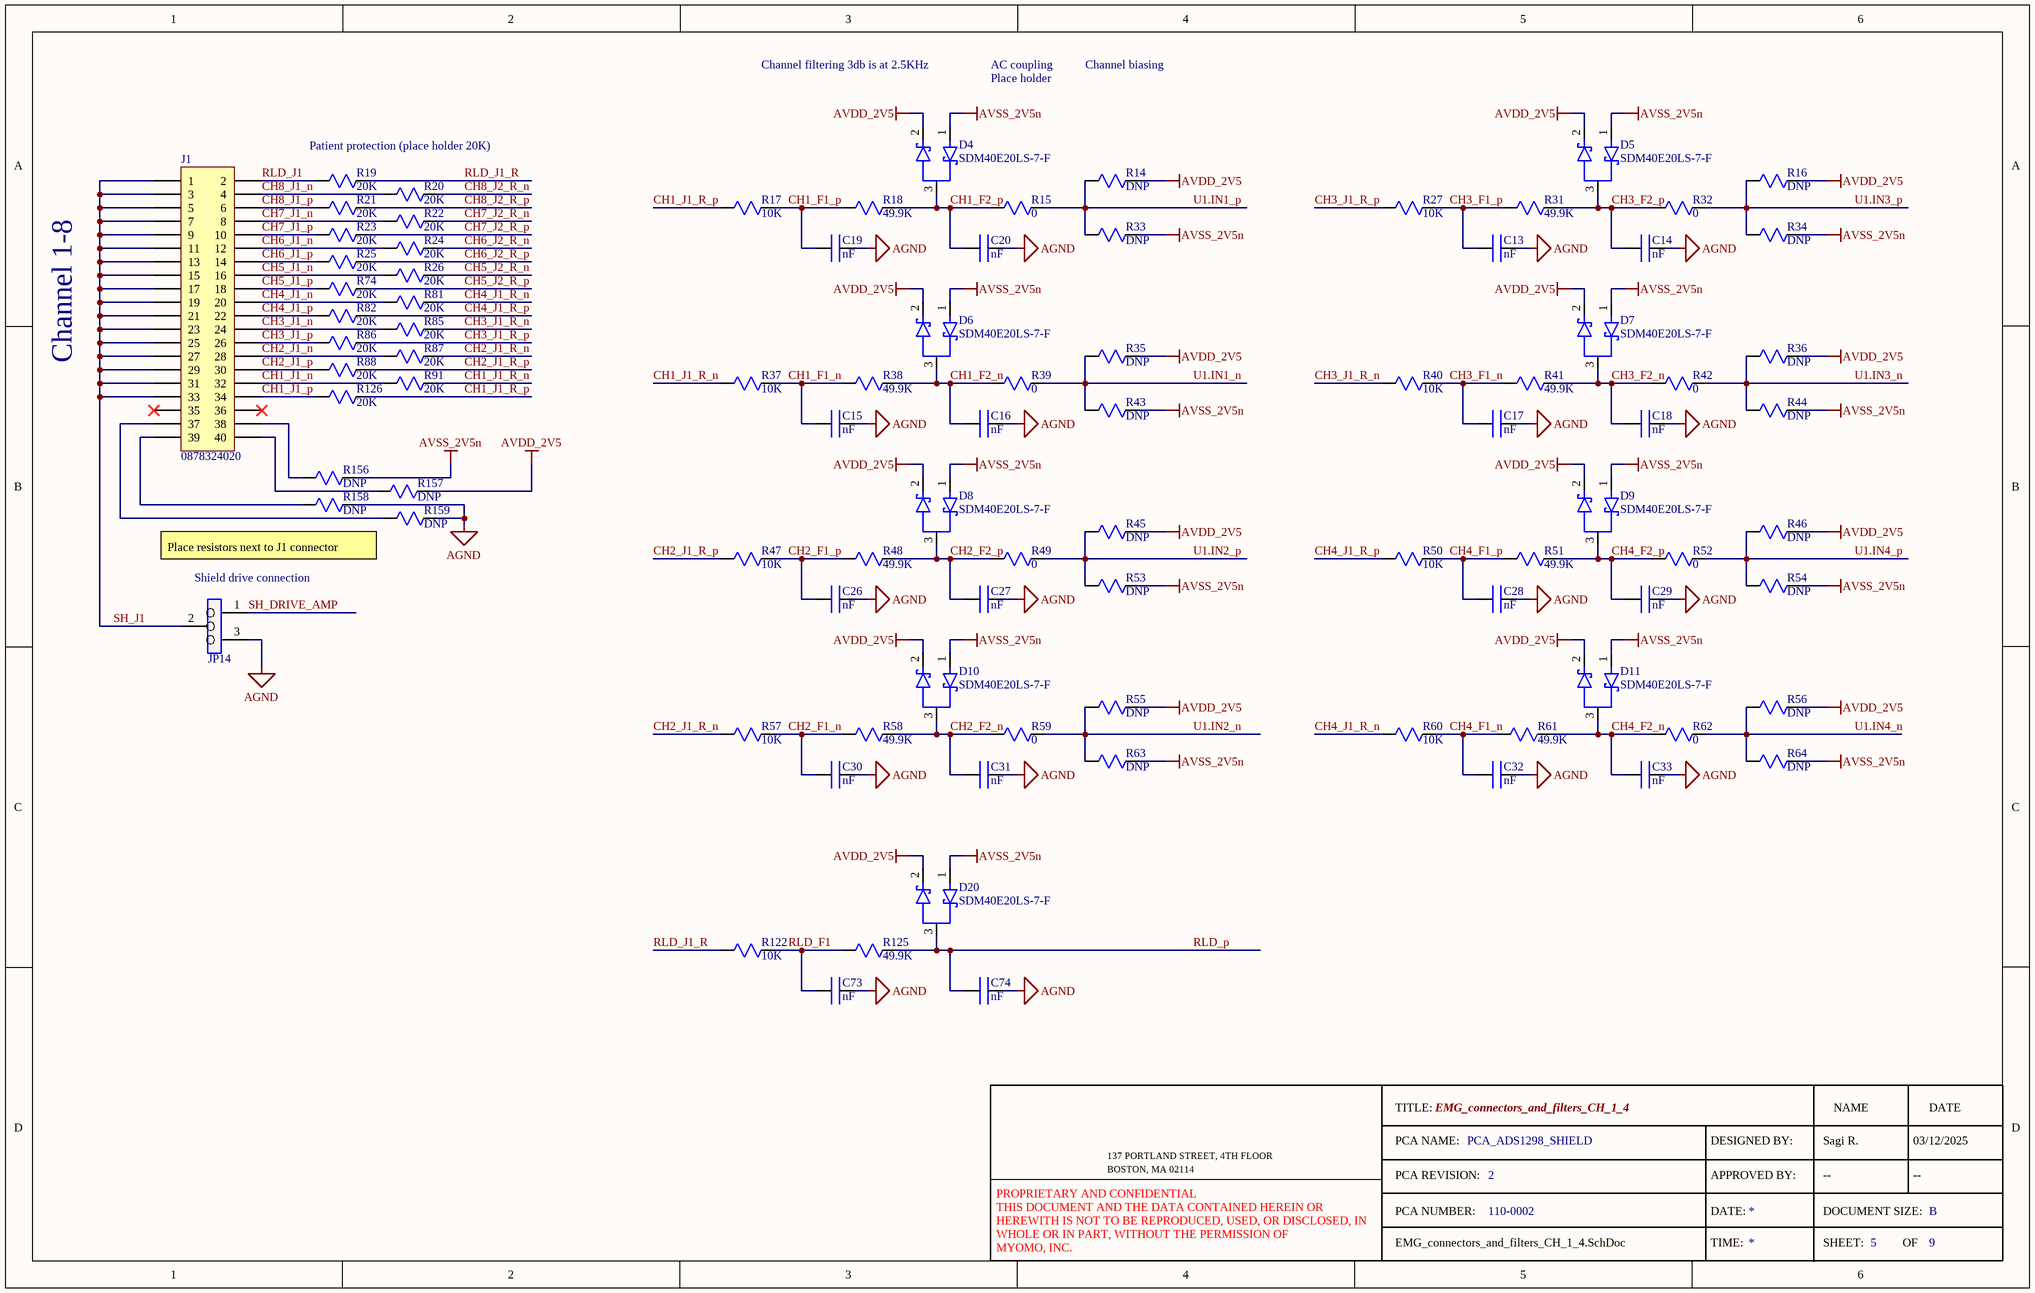
[diagram p4: EMG_connectors_and_filters_CH_1_4.SchDoc]

### Parts
C13  nF  [0402]
C14  nF  [0402]
C15  nF  [0402]
C16  nF  [0402]
C17  nF  [0402]
C18  nF  [0402]
C19  nF  [0402]
C20  nF  [0402]
C26  nF  [0402]
C27  nF  [0402]
C28  nF  [0402]
C29  nF  [0402]
C30  nF  [0402]
C31  nF  [0402]
C32  nF  [0402]
C33  nF  [0402]
C73  nF  [0402]
C74  nF  [0402]
D4  SDM40E20LS-7-F  [D_SCHOTT_0.31mV_400mA]
D5  SDM40E20LS-7-F  [D_SCHOTT_0.31mV_400mA]
D6  SDM40E20LS-7-F  [D_SCHOTT_0.31mV_400mA]
D7  SDM40E20LS-7-F  [D_SCHOTT_0.31mV_400mA]
D8  SDM40E20LS-7-F  [D_SCHOTT_0.31mV_400mA]
D9  SDM40E20LS-7-F  [D_SCHOTT_0.31mV_400mA]
D10  SDM40E20LS-7-F  [D_SCHOTT_0.31mV_400mA]
D11  SDM40E20LS-7-F  [D_SCHOTT_0.31mV_400mA]
D20  SDM40E20LS-7-F  [D_SCHOTT_0.31mV_400mA]
J1  0878324020  [J_MOLEX_0878324020]
JP14  JP_1x3_TSW-103-07-F-S  [JP_1x3_TSW-103-07-F-S]  (value not drawn)
R14  DNP  [0402]  (no BOM)
R15  0  [0402]
R16  DNP  [0402]  (no BOM)
R17  10K  [0402]
R18  49.9K  [0402]
R19  20K  [0603]
R20  20K  [0603]
R21  20K  [0603]
R22  20K  [0603]
R23  20K  [0603]
R24  20K  [0603]
R25  20K  [0603]
R26  20K  [0603]
R27  10K  [0402]
R31  49.9K  [0402]
R32  0  [0402]
R33  DNP  [0402]  (no BOM)
R34  DNP  [0402]  (no BOM)
R35  DNP  [0402]  (no BOM)
R36  DNP  [0402]  (no BOM)
R37  10K  [0402]
R38  49.9K  [0402]
R39  0  [0402]
R40  10K  [0402]
R41  49.9K  [0402]
R42  0  [0402]
R43  DNP  [0402]  (no BOM)
R44  DNP  [0402]  (no BOM)
R45  DNP  [0402]  (no BOM)
R46  DNP  [0402]  (no BOM)
R47  10K  [0402]
R48  49.9K  [0402]
R49  0  [0402]
R50  10K  [0402]
R51  49.9K  [0402]
R52  0  [0402]
R53  DNP  [0402]  (no BOM)
R54  DNP  [0402]  (no BOM)
R55  DNP  [0402]  (no BOM)
R56  DNP  [0402]  (no BOM)
R57  10K  [0402]
R58  49.9K  [0402]
R59  0  [0402]
R60  10K  [0402]
R61  49.9K  [0402]
R62  0  [0402]
R63  DNP  [0402]  (no BOM)
R64  DNP  [0402]  (no BOM)
R74  20K  [0603]
R81  20K  [0603]
R82  20K  [0603]
R85  20K  [0603]
R86  20K  [0603]
R87  20K  [0603]
R88  20K  [0603]
R91  20K  [0603]
R122  10K  [0402]
R125  49.9K  [0402]
R126  20K  [0603]
R156  DNP  [0603]  (no BOM)
R157  DNP  [0603]  (no BOM)
R158  DNP  [0603]  (no BOM)
R159  DNP  [0603]  (no BOM)

### Nets
AGND: C13.2 C14.2 C15.2 C16.2 C17.2 C18.2 C19.2 C20.2 C26.2 C27.2 C28.2 C29.2 C30.2 C31.2 C32.2 C33.2 C73.2 C74.2 JP14.3 R158.2 R159.2
AVDD_2V5: D4.2(A2) D5.2(A2) D6.2(A2) D7.2(A2) D8.2(A2) D9.2(A2) D10.2(A2) D11.2(A2) D20.2(A2) R14.2 R16.2 R35.2 R36.2 R45.2 R46.2 R55.2 R56.2 R157.2
AVSS_2V5n: D4.1(A1) D5.1(A1) D6.1(A1) D7.1(A1) D8.1(A1) D9.1(A1) D10.1(A1) D11.1(A1) D20.1(A1) R33.2 R34.2 R43.2 R44.2 R53.2 R54.2 R63.2 R64.2 R156.2
CH1_F1_n: C15.1 R37.2 R38.1
CH1_F1_p: C19.1 R17.2 R18.1
CH1_F2_n: C16.1 D6.3(K) R38.2 R39.1
CH1_F2_p: C20.1 D4.3(K) R15.1 R18.2
CH1_J1_n: J1.32 R91.1
CH1_J1_p: J1.34 R126.1
CH1_J1_R_n: R37.1 R91.2
CH1_J1_R_p: R17.1 R126.2
CH2_F1_n: C30.1 R57.2 R58.1
CH2_F1_p: C26.1 R47.2 R48.1
CH2_F2_n: C31.1 D10.3(K) R58.2 R59.1
CH2_F2_p: C27.1 D8.3(K) R48.2 R49.1
CH2_J1_n: J1.28 R87.1
CH2_J1_p: J1.30 R88.1
CH2_J1_R_n: R57.1 R87.2
CH2_J1_R_p: R47.1 R88.2
CH3_F1_n: C17.1 R40.2 R41.1
CH3_F1_p: C13.1 R27.2 R31.1
CH3_F2_n: C18.1 D7.3(K) R41.2 R42.1
CH3_F2_p: C14.1 D5.3(K) R31.2 R32.1
CH3_J1_n: J1.24 R85.1
CH3_J1_p: J1.26 R86.1
CH3_J1_R_n: R40.1 R85.2
CH3_J1_R_p: R27.1 R86.2
CH4_F1_n: C32.1 R60.2 R61.1
CH4_F1_p: C28.1 R50.2 R51.1
CH4_F2_n: C33.1 D11.3(K) R61.2 R62.1
CH4_F2_p: C29.1 D9.3(K) R51.2 R52.1
CH4_J1_n: J1.20 R81.1
CH4_J1_p: J1.22 R82.1
CH4_J1_R_n: R60.1 R81.2
CH4_J1_R_p: R50.1 R82.2
CH5_J1_n: J1.16 R26.1
CH5_J1_p: J1.18 R74.1
CH5_J2_R_n: R26.2
CH5_J2_R_p: R74.2
CH6_J1_n: J1.12 R24.1
CH6_J1_p: J1.14 R25.1
CH6_J2_R_n: R24.2
CH6_J2_R_p: R25.2
CH7_J1_n: J1.8 R22.1
CH7_J1_p: J1.10 R23.1
CH7_J2_R_n: R22.2
CH7_J2_R_p: R23.2
CH8_J1_n: J1.4 R20.1
CH8_J1_p: J1.6 R21.1
CH8_J2_R_n: R20.2
CH8_J2_R_p: R21.2
RLD_F1: C73.1 R122.2 R125.1
RLD_J1: J1.2 R19.1
RLD_J1_R: R19.2 R122.1
RLD_p: C74.1 D20.3(K) R125.2
SH_DRIVE_AMP: JP14.1
SH_J1: J1.1 J1.3 J1.5 J1.7 J1.9 J1.11 J1.13 J1.15 J1.17 J1.19 J1.21 J1.23 J1.25 J1.27 J1.29 J1.31 J1.33 JP14.2
U1.IN1_n: R35.1 R39.2 R43.1
U1.IN1_p: R14.1 R15.2 R33.1
U1.IN2_n: R55.1 R59.2 R63.1
U1.IN2_p: R45.1 R49.2 R53.1
U1.IN3_n: R36.1 R42.2 R44.1
U1.IN3_p: R16.1 R32.2 R34.1
U1.IN4_n: R56.1 R62.2 R64.1
U1.IN4_p: R46.1 R52.2 R54.1
NetJ1_37: J1.37 R159.1
NetJ1_38: J1.38 R156.1
NetJ1_39: J1.39 R158.1
NetJ1_40: J1.40 R157.1

Not connected (* = marked no-connect by the designer): J1 35* 36*

### Notes on the sheet
- Channel filtering 3db is at 2.5KHz
- AC coupling
- Place holder
- Channel biasing
- Patient protection (place holder 20K)
- Channel 1-8
- Place resistors next to J1 connector
- (near JP14) Shield drive connection
- TITLE:
- NAME
- DATE
- PCA REVISION:
- PCA NAME:
- APPROVED BY:
- DESIGNED BY:
- PCA NUMBER:
- DATE:
- TIME:
- DOCUMENT SIZE:
- SHEET:
- OF
- B
- PROPRIETARY AND CONFIDENTIAL
  THIS DOCUMENT AND THE DATA CONTAINED HEREIN OR HEREWITH IS NOT TO BE REPRODUCED, USED, OR DISCLOSED, IN WHOLE OR IN PART, WITHOUT THE PERMISSION OF
  MYOMO, INC.

### Library data of the parts
C13-C20 C26-C33 C73 C74 = C_0402_CER_1nF_50V_X7R: CAP CER 1000PF 50V X7R 0402; MFG: Samsung; MFGPN: CL05B102KB5NNNC; Myomo PN: 201-0019
D4-D11 D20 = D_SCHOTT_0.31mV_400mA: DIODE ARR SCHOTT 20V 400MA SOT23; MFG: Diodes Incorporated; Myomo PN: 203-0006; MFGPN: SDM40E20LS-7-F
J1 = J_MOLEX_0878324020: CONN HEADER SMD 40POS 2MM PITCH; MFG: Molex; Myomo PN: 211-0011; MFGPN: 0878324020; ComponentLink1Description: New link; ComponentLink1URL: *
JP14 = JP_1x3_TSW-103-07-F-S: as JP12 on sheet ADS1298; MFGPN: TSW-103-07-F-S
R14 R16 R33-R36 R43-R46 R53-R56 R63 R64 = R_0402_DNP: RES 0402 DNP
R15 R32 R39 R42 R49 R52 R59 R62 = R_0402_0: as R120 on sheet Regulators
R17 R27 R37 R40 R47 R50 R57 R60 R122 = R_0402_10K_1%_1/10W: as R28 on sheet Regulators
R18 R31 R38 R41 R48 R51 R58 R61 R125 = R_0402_49.9K_1%_1/10W: RES SMD 49.9 OHM 1% 1/10W 0402; MFG: Panasonic; MFGPN: ERJ-2RKF49R9X; Myomo PN: 200-0027
R19-R26 R74 R81 R82 R85-R88 R91 R126 = R_0603_20K_1%_1/10W: RES 20K OHM 1% 1/10W 0603; MFG: YAGEO; MFGPN: RC0603FR-0720KL; Myomo PN: 200-0026
R156-R159 = R_0603_DNP: RES 0603 DNP

## Sheet EMG_connectors_and_filters_CH_5_8.SchDoc: EMG_connectors_and_filters_CH_5_8
size B; Organization: Myomo; Address1: 137 PORTLAND STREET, 4TH FLOOR; Address2: BOSTON, MA 02114; Address3: USA; SheetNumber: 6
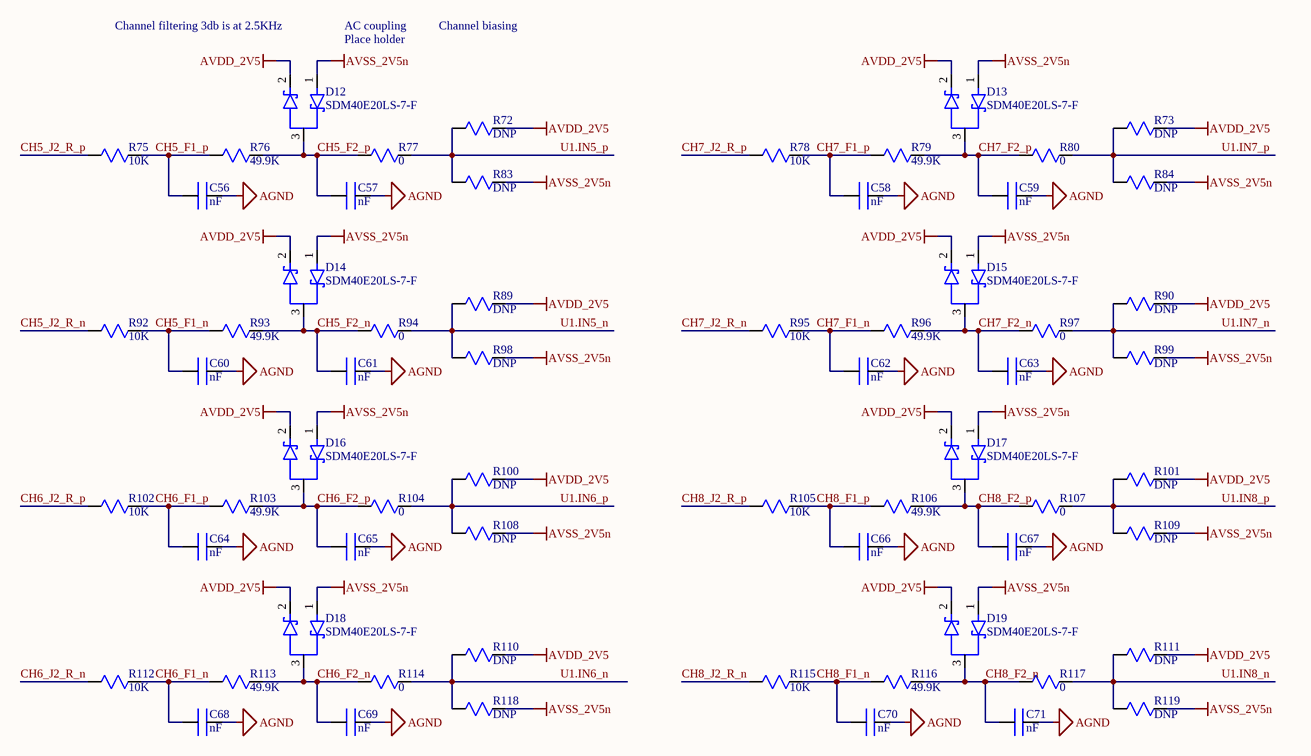
[diagram p5: EMG_connectors_and_filters_CH_5_8.SchDoc]

### Parts
C56  nF  [0402]
C57  nF  [0402]
C58  nF  [0402]
C59  nF  [0402]
C60  nF  [0402]
C61  nF  [0402]
C62  nF  [0402]
C63  nF  [0402]
C64  nF  [0402]
C65  nF  [0402]
C66  nF  [0402]
C67  nF  [0402]
C68  nF  [0402]
C69  nF  [0402]
C70  nF  [0402]
C71  nF  [0402]
D12  SDM40E20LS-7-F  [D_SCHOTT_0.31mV_400mA]
D13  SDM40E20LS-7-F  [D_SCHOTT_0.31mV_400mA]
D14  SDM40E20LS-7-F  [D_SCHOTT_0.31mV_400mA]
D15  SDM40E20LS-7-F  [D_SCHOTT_0.31mV_400mA]
D16  SDM40E20LS-7-F  [D_SCHOTT_0.31mV_400mA]
D17  SDM40E20LS-7-F  [D_SCHOTT_0.31mV_400mA]
D18  SDM40E20LS-7-F  [D_SCHOTT_0.31mV_400mA]
D19  SDM40E20LS-7-F  [D_SCHOTT_0.31mV_400mA]
R72  DNP  [0402]  (no BOM)
R73  DNP  [0402]  (no BOM)
R75  10K  [0402]
R76  49.9K  [0402]
R77  0  [0402]
R78  10K  [0402]
R79  49.9K  [0402]
R80  0  [0402]
R83  DNP  [0402]  (no BOM)
R84  DNP  [0402]  (no BOM)
R89  DNP  [0402]  (no BOM)
R90  DNP  [0402]  (no BOM)
R92  10K  [0402]
R93  49.9K  [0402]
R94  0  [0402]
R95  10K  [0402]
R96  49.9K  [0402]
R97  0  [0402]
R98  DNP  [0402]  (no BOM)
R99  DNP  [0402]  (no BOM)
R100  DNP  [0402]  (no BOM)
R101  DNP  [0402]  (no BOM)
R102  10K  [0402]
R103  49.9K  [0402]
R104  0  [0402]
R105  10K  [0402]
R106  49.9K  [0402]
R107  0  [0402]
R108  DNP  [0402]  (no BOM)
R109  DNP  [0402]  (no BOM)
R110  DNP  [0402]  (no BOM)
R111  DNP  [0402]  (no BOM)
R112  10K  [0402]
R113  49.9K  [0402]
R114  0  [0402]
R115  10K  [0402]
R116  49.9K  [0402]
R117  0  [0402]
R118  DNP  [0402]  (no BOM)
R119  DNP  [0402]  (no BOM)

### Nets
AGND: C56.2 C57.2 C58.2 C59.2 C60.2 C61.2 C62.2 C63.2 C64.2 C65.2 C66.2 C67.2 C68.2 C69.2 C70.2 C71.2
AVDD_2V5: D12.2(A2) D13.2(A2) D14.2(A2) D15.2(A2) D16.2(A2) D17.2(A2) D18.2(A2) D19.2(A2) R72.2 R73.2 R89.2 R90.2 R100.2 R101.2 R110.2 R111.2
AVSS_2V5n: D12.1(A1) D13.1(A1) D14.1(A1) D15.1(A1) D16.1(A1) D17.1(A1) D18.1(A1) D19.1(A1) R83.2 R84.2 R98.2 R99.2 R108.2 R109.2 R118.2 R119.2
CH5_F1_n: C60.1 R92.2 R93.1
CH5_F1_p: C56.1 R75.2 R76.1
CH5_F2_n: C61.1 D14.3(K) R93.2 R94.1
CH5_F2_p: C57.1 D12.3(K) R76.2 R77.1
CH5_J2_R_n: R92.1
CH5_J2_R_p: R75.1
CH6_F1_n: C68.1 R112.2 R113.1
CH6_F1_p: C64.1 R102.2 R103.1
CH6_F2_n: C69.1 D18.3(K) R113.2 R114.1
CH6_F2_p: C65.1 D16.3(K) R103.2 R104.1
CH6_J2_R_n: R112.1
CH6_J2_R_p: R102.1
CH7_F1_n: C62.1 R95.2 R96.1
CH7_F1_p: C58.1 R78.2 R79.1
CH7_F2_n: C63.1 D15.3(K) R96.2 R97.1
CH7_F2_p: C59.1 D13.3(K) R79.2 R80.1
CH7_J2_R_n: R95.1
CH7_J2_R_p: R78.1
CH8_F1_n: C70.1 R115.2 R116.1
CH8_F1_p: C66.1 R105.2 R106.1
CH8_F2_n: C71.1 D19.3(K) R116.2 R117.1
CH8_F2_p: C67.1 D17.3(K) R106.2 R107.1
CH8_J2_R_n: R115.1
CH8_J2_R_p: R105.1
U1.IN5_n: R89.1 R94.2 R98.1
U1.IN5_p: R72.1 R77.2 R83.1
U1.IN6_n: R110.1 R114.2 R118.1
U1.IN6_p: R100.1 R104.2 R108.1
U1.IN7_n: R90.1 R97.2 R99.1
U1.IN7_p: R73.1 R80.2 R84.1
U1.IN8_n: R111.1 R117.2 R119.1
U1.IN8_p: R101.1 R107.2 R109.1

### Notes on the sheet
- Channel filtering 3db is at 2.5KHz
- AC coupling
- (near D12) Place holder
- Channel biasing
- TITLE:
- NAME
- DATE
- PCA REVISION:
- PCA NAME:
- APPROVED BY:
- DESIGNED BY:
- PCA NUMBER:
- DATE:
- TIME:
- DOCUMENT SIZE:
- SHEET:
- OF
- B
- PROPRIETARY AND CONFIDENTIAL
  THIS DOCUMENT AND THE DATA CONTAINED HEREIN OR HEREWITH IS NOT TO BE REPRODUCED, USED, OR DISCLOSED, IN WHOLE OR IN PART, WITHOUT THE PERMISSION OF
  MYOMO, INC.

### Library data of the parts
C56-C71 = C_0402_CER_1nF_50V_X7R: as C13 on sheet EMG_connectors_and_filters_CH_1_4
D12-D19 = D_SCHOTT_0.31mV_400mA: as D4 on sheet EMG_connectors_and_filters_CH_1_4; MFGPN: SDM40E20LS-7-F
R72 R73 R83 R84 R89 R90 R98-R101 R108-R111 R118 R119 = R_0402_DNP: RES 0402 DNP
R75 R78 R92 R95 R102 R105 R112 R115 = R_0402_10K_1%_1/10W: as R28 on sheet Regulators
R76 R79 R93 R96 R103 R106 R113 R116 = R_0402_49.9K_1%_1/10W: as R18 on sheet EMG_connectors_and_filters_CH_1_4
R77 R80 R94 R97 R104 R107 R114 R117 = R_0402_0: as R120 on sheet Regulators

## Sheet CAN.SchDoc: CAN
size B; Organization: Myomo; Address1: 137 PORTLAND STREET, 4TH FLOOR; Address2: BOSTON, MA 02114; Address3: USA; SheetNumber: 7
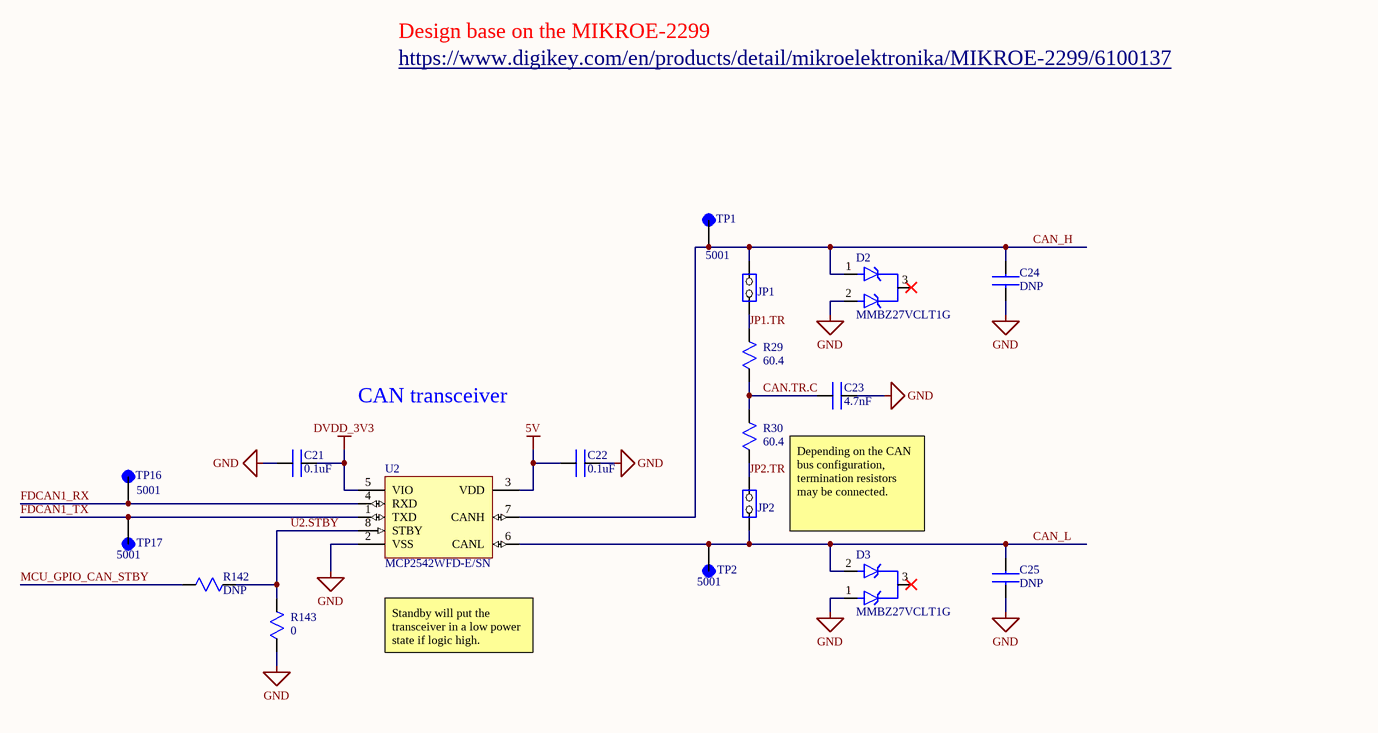
[diagram p6: CAN.SchDoc]

### Parts
C21  0.1uF  [0603]
C22  0.1uF  [0603]
C23  4.7nF  [0603]
C24  DNP  [0603]  (no BOM)
C25  DNP  [0603]  (no BOM)
D2  MMBZ27VCLT1G  [D_TVS_38V_40W]
D3  MMBZ27VCLT1G  [D_TVS_38V_40W]
JP1  JP_1x2_TSW-102-07-F-S  [JP_1x2_TSW-102-07-F-S]  (value not drawn)
JP2  JP_1x2_TSW-102-07-F-S  [JP_1x2_TSW-102-07-F-S]  (value not drawn)
R29  60.4  [0603]
R30  60.4  [0603]
R142  DNP  [0402]  (no BOM)
R143  0  [0402]
TP1  5001  [TP_CLIP_BLK_5001]
TP2  5001  [TP_CLIP_BLK_5001]
TP16  5001  [TP_CLIP_BLK_5001]
TP17  5001  [TP_CLIP_BLK_5001]
U2  MCP2542WFD-E/SN  [U_MCP2542WFD-E/SN]

### Nets
5V: C22.1 U2.3(VDD)
DVDD_3V3: C21.2 U2.5(VIO)
GND: C21.1 C22.2 C23.2 C24.2 C25.2 D2.2(A2) D3.1(A1) R143.2 U2.2(VSS)
CAN.TR.C: C23.1 R29.2 R30.1
CAN_H: C24.1 D2.1(A1) JP1.1 TP1.TP U2.7(CANH)
CAN_L: C25.1 D3.2(A2) JP2.1 TP2.TP U2.6(CANL)
FDCAN1_RX: TP16.TP U2.4(RXD)
FDCAN1_TX: TP17.TP U2.1(TXD)
JP1.TR: JP1.2 R29.1
JP2.TR: JP2.2 R30.2
MCU_GPIO_CAN_STBY: R142.1
U2.STBY: R142.2 R143.1 U2.8(STBY)

Not connected (* = marked no-connect by the designer): D2 3(K)*; D3 3(K)*

### Notes on the sheet
- Design base on the MIKROE-2299
- https://www.digikey.com/en/products/detail/mikroelektronika/MIKROE-2299/6100137
- CAN transceiver
- Depending on the CAN bus configuration, termination resistors  may be connected.
- Standby will put the transceiver in a low power state if logic high.
- TITLE:
- NAME
- DATE
- PCA REVISION:
- PCA NAME:
- APPROVED BY:
- DESIGNED BY:
- PCA NUMBER:
- DATE:
- TIME:
- DOCUMENT SIZE:
- SHEET:
- OF
- B
- PROPRIETARY AND CONFIDENTIAL
  THIS DOCUMENT AND THE DATA CONTAINED HEREIN OR HEREWITH IS NOT TO BE REPRODUCED, USED, OR DISCLOSED, IN WHOLE OR IN PART, WITHOUT THE PERMISSION OF
  MYOMO, INC.

### Library data of the parts
C21 C22 = C_0603_CER_0.1uF_100V_X7R: as C51 on sheet Regulators_2
C23 = C_0603_CER_4.7nF_100V_X7R: CAP CER 4700PF 100V X7R 0603; MFG: SAMSUNG; MFGPN: CL10B472KC8WPNC; Myomo PN: 201-0010
C24 C25 = C_0603_DNP: CAP CER 0603 DNP
D2 D3 = D_TVS_38V_40W: TVS DIODE 22VWM 38VC SOT23-3; MFG: Onsemi; Myomo PN: 203-0002; MFGPN: MMBZ27VCLT1G
JP1 JP2 = JP_1x2_TSW-102-07-F-S: as JP4 on sheet ADS1298; MFGPN: TSW-102-07-F-S
R29 R30 = R_0603_60.4_1%_1/10W: RES 60.4 OHM 1% 1/10W 0603; MFG: YAGEO; MFGPN: RC0603FR-0760R4L; Myomo PN: 200-0008
R142 = R_0402_DNP: RES 0402 DNP
R143 = R_0402_0: as R120 on sheet Regulators
TP1 TP2 TP16 TP17 = TP_CLIP_BLK_5001: as TP7 on sheet Regulators; MFGPN: 5001
U2 = U_MCP2542WFD-E/SN: IC CAN TRANSCEIVER 1/1 8SOIC; MFG: Microchip; Myomo PN: 204-0001; MFGPN: MCP2542WFD-E/SN; Supplier 1: DigiKey; Supplier Part Number 1: MCP2542WFD-E/SN-ND

## Sheet STM32_POWER.SchDoc: STM32_POWER
size B; Organization: Myomo; Address3: USA; SheetNumber: 8
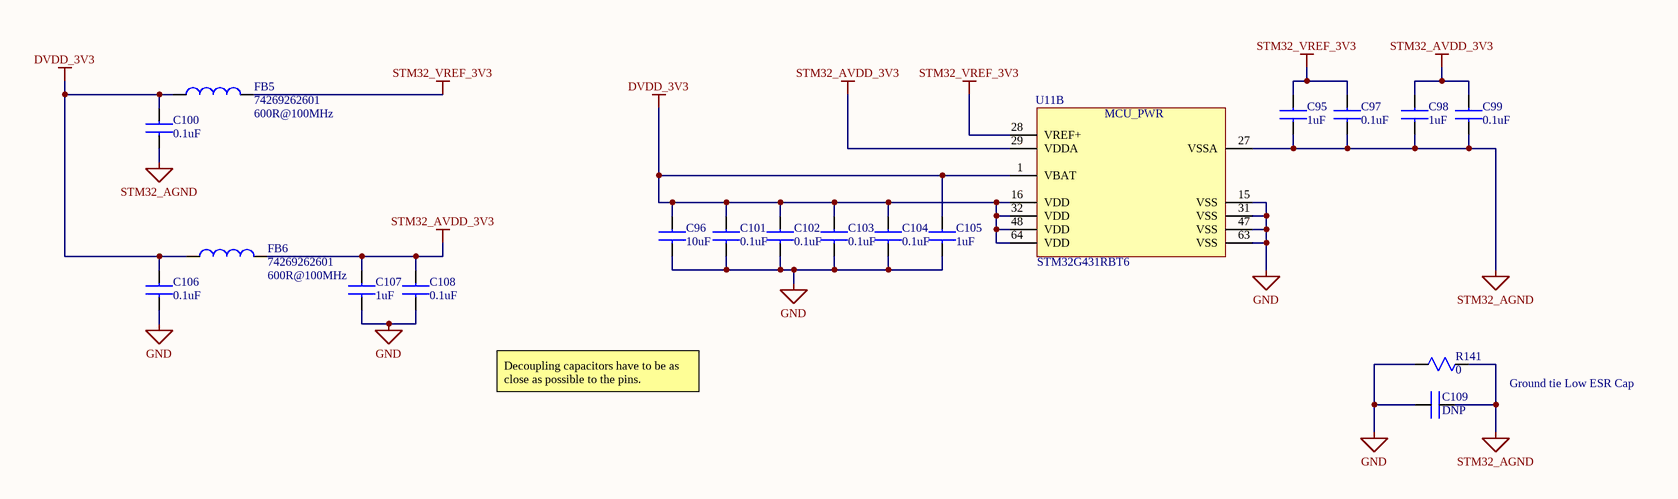
[diagram p7: STM32_POWER.SchDoc]

### Parts
C95  1uF  [0603]
C96  10uF  [1210]
C97  0.1uF  [0402]
C98  1uF  [0603]
C99  0.1uF  [0402]
C100  0.1uF  [0402]
C101  0.1uF  [0402]
C102  0.1uF  [0402]
C103  0.1uF  [0402]
C104  0.1uF  [0402]
C105  1uF  [0603]
C106  0.1uF  [0402]
C107  1uF  [0603]
C108  0.1uF  [0402]
C109  DNP  [0603]  (no BOM)
FB5  74269262601  [0603]
FB6  74269262601  [0603]
R141  0  [0603]
U11  STM32G431RBT6  [U_STM32G431R]  (part B of 2)

### Nets
DVDD_3V3: C96.1 C100.1 C101.1 C102.1 C103.1 C104.1 C105.1 C106.1 FB5.1 FB6.1 U11.1(VBAT) U11.16(VDD) U11.32(VDD) U11.48(VDD) U11.64(VDD)
GND: C96.2 C101.2 C102.2 C103.2 C104.2 C105.2 C106.2 C107.2 C108.2 C109.1 R141.1 U11.15(VSS) U11.31(VSS) U11.47(VSS) U11.63(VSS)
STM32_AGND: C95.2 C97.2 C98.2 C99.2 C100.2 C109.2 R141.2 U11.27(VSSA)
STM32_AVDD_3V3: C98.1 C99.1 C107.1 C108.1 FB6.2 U11.29(VDDA)
STM32_VREF_3V3: C95.1 C97.1 FB5.2 U11.28(VREF+)

### Notes on the sheet
- Decoupling capacitors have to be as close as possible to the pins.
- Ground tie Low ESR Cap
- TITLE:
- NAME
- DATE
- PCA REVISION:
- PCA NAME:
- APPROVED BY:
- DESIGNED BY:
- PCA NUMBER:
- DATE:
- TIME:
- DOCUMENT SIZE:
- SHEET:
- OF
- B
- PROPRIETARY AND CONFIDENTIAL
  THIS DOCUMENT AND THE DATA CONTAINED HEREIN OR HEREWITH IS NOT TO BE REPRODUCED, USED, OR DISCLOSED, IN WHOLE OR IN PART, WITHOUT THE PERMISSION OF
  MYOMO, INC.
- (in symbol FB_0603 _600_100MHz_1.5A) 600R@100MHz
- (in symbol U_STM32G431R, part B) MCU_PWR

### Library data of the parts
C95 C98 C105 C107 = C_0603_CER_1uF_50V_X7R: as C11 on sheet Regulators
C96 = C_1210_CER_10uF_25V_X7R: as C10 on sheet Regulators
C97 C99-C104 C106 C108 = C_0402_CER_0.1uF_50V_X7R: as C38 on sheet Regulators
C109 = C_0603_DNP: CAP CER 0603 DNP
FB5 FB6 = FB_0603 _600_100MHz_1.5A: as FB1 on sheet Regulators_2; MFGPN: 74269262601
R141 = R_0603_0: as R130 on sheet Regulators_2
U11 = U_STM32G431R: STM32G431, LQFP64 package; MFG: STMicroelectronics; Myomo PN: 204-0012; MFGPN: STM32G431RBT6

## Sheet STM32_IO.SchDoc: STM32_IO
size B; Organization: Myomo; Address3: USA; SheetNumber: 9
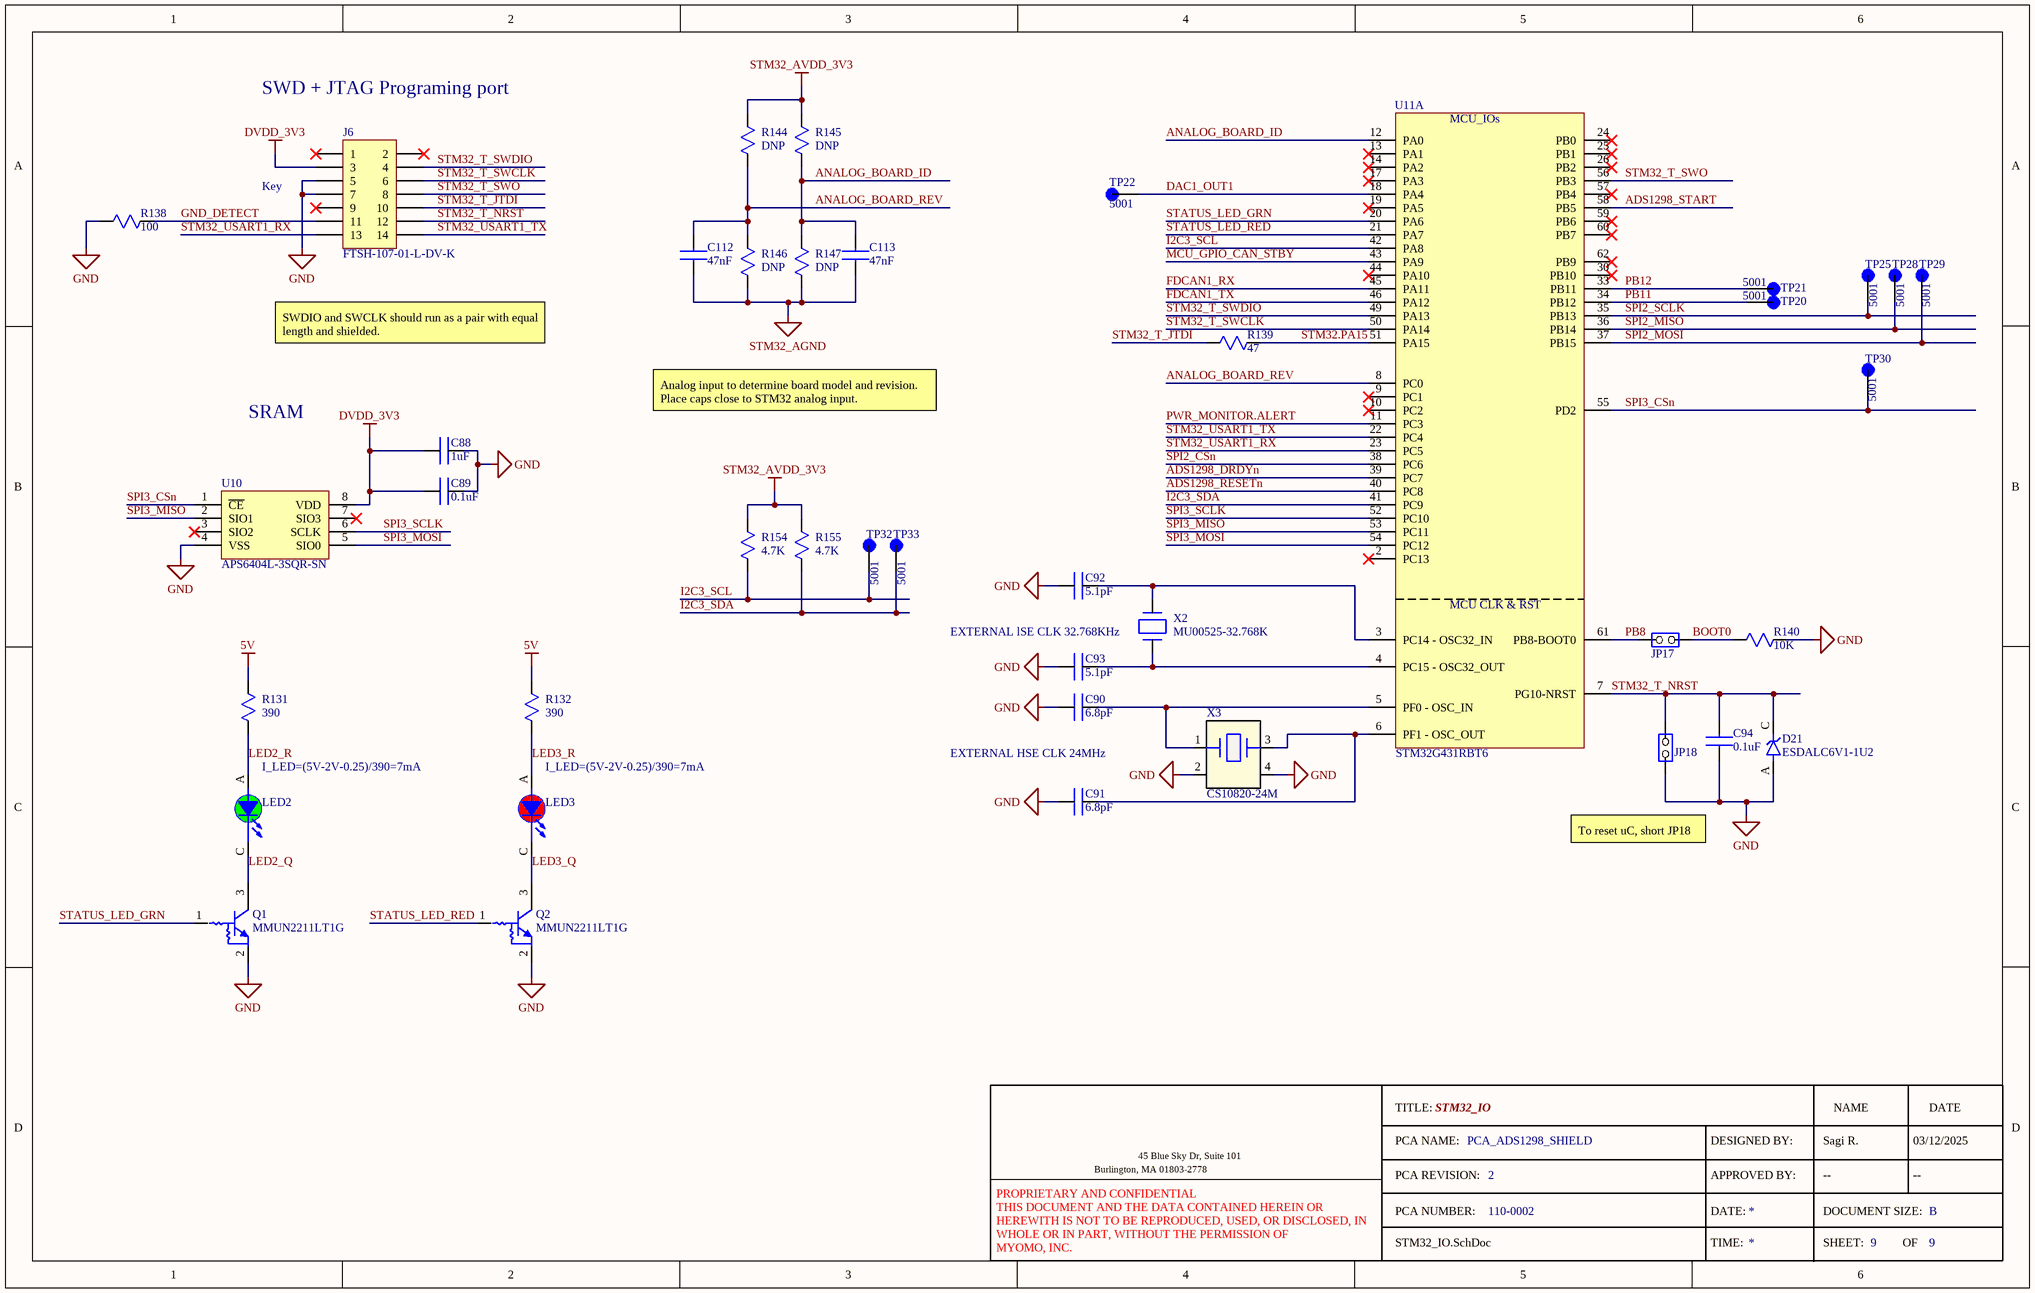
[diagram p8: STM32_IO.SchDoc]

### Parts
C88  1uF  [0603]
C89  0.1uF  [0402]
C90  6.8pF  [0402]
C91  6.8pF  [0402]
C92  5.1pF  [0402]
C93  5.1pF  [0402]
C94  0.1uF  [0402]
C112  47nF  [0402]
C113  47nF  [0402]
D21  ESDALC6V1-1U2  [D_TVS_6.1V_20W]
J6  FTSH-107-01-L-DV-K  [J_SAMTEC_FTSH-107-01-L-DV-K]
JP17  JP_1x2_TSW-102-07-F-S  [JP_1x2_TSW-102-07-F-S]  (value not drawn)
JP18  JP_1x2_TSW-102-07-F-S  [JP_1x2_TSW-102-07-F-S]  (value not drawn)
LED2  D_LED_GREEN_LTST  [D_LED_GREEN_LTST]  (value not drawn)
LED3  D_LED_RED_LTST  [D_LED_RED_LTST]  (value not drawn)
Q1  MMUN2211LT1G  [Q_NPN_PREBIAS_MMUN2211LT1G]
Q2  MMUN2211LT1G  [Q_NPN_PREBIAS_MMUN2211LT1G]
R131  390  [0603]
R132  390  [0603]
R138  100  [0402]
R139  47  [0402]
R140  10K  [0402]
R144  DNP  [0603]  (no BOM)
R145  DNP  [0603]  (no BOM)
R146  DNP  [0603]  (no BOM)
R147  DNP  [0603]  (no BOM)
R154  4.7K  [0402]
R155  4.7K  [0402]
TP20  5001  [TP_CLIP_BLK_5001]
TP21  5001  [TP_CLIP_BLK_5001]
TP22  5001  [TP_CLIP_BLK_5001]
TP25  5001  [TP_CLIP_BLK_5001]
TP28  5001  [TP_CLIP_BLK_5001]
TP29  5001  [TP_CLIP_BLK_5001]
TP30  5001  [TP_CLIP_BLK_5001]
TP32  5001  [TP_CLIP_BLK_5001]
TP33  5001  [TP_CLIP_BLK_5001]
U10  APS6404L-3SQR-SN  [U_APS6404L-3SQR-SN]
U11  STM32G431RBT6  [U_STM32G431R]  (part A of 2)
X2  MU00525-32.768K  [XTAL_32.768KHZ_20PPM]
X3  CS10820-24M  [XTAL_24.0000MHZ_15PPM]

### Nets
5V: R131.1 R132.1
DVDD_3V3: C88.1 C89.1 J6.3 U10.8(VDD)
GND: C88.2 C89.2 C90.1 C91.1 C92.1 C93.1 C94.2 D21.A J6.5 J6.7 JP18.1 Q1.2(E) Q2.2(E) R138.1 R140.2 U10.4(VSS) X3.2(X2) X3.4(X4)
STM32_AGND: C112.2 C113.2 R146.2 R147.2
STM32_AVDD_3V3: R144.1 R145.1 R154.1 R155.1
ADS1298_DRDYn: U11.39(PC7)
ADS1298_RESETn: U11.40(PC8)
ADS1298_START: U11.58(PB5)
ANALOG_BOARD_ID: C113.1 R145.2 R147.1 U11.12(PA0)
ANALOG_BOARD_REV: C112.1 R144.2 R146.1 U11.8(PC0)
BOOT0: JP17.2 R140.1
DAC1_OUT1: TP22.TP U11.18(PA4)
FDCAN1_RX: U11.45(PA11)
FDCAN1_TX: U11.46(PA12)
GND_DETECT: J6.11 R138.2
I2C3_SCL: R154.2 TP32.TP U11.42(PA8)
I2C3_SDA: R155.2 TP33.TP U11.41(PC9)
LED2_Q: LED2.C(CATHODE) Q1.3(C)
LED2_R: LED2.A(ANODE) R131.2
LED3_Q: LED3.C(CATHODE) Q2.3(C)
LED3_R: LED3.A(ANODE) R132.2
MCU_GPIO_CAN_STBY: U11.43(PA9)
PB8: JP17.1 U11.61(PB8-BOOT0)
PB11: TP20.TP U11.34(PB12)
PB12: TP21.TP U11.33(PB11)
PWR_MONITOR.ALERT: U11.11(PC3)
SPI2_CSn: U11.38(PC6)
SPI2_MISO: TP28.TP U11.36(PB14)
SPI2_MOSI: TP29.TP U11.37(PB15)
SPI2_SCLK: TP25.TP U11.35(PB13)
SPI3_CSn: TP30.TP U10.1(~{CE}) U11.55(PD2)
SPI3_MISO: U10.2(SIO1) U11.53(PC11)
SPI3_MOSI: U10.5(SIO0) U11.54(PC12)
SPI3_SCLK: U10.6(SCLK) U11.52(PC10)
STATUS_LED_GRN: Q1.1(B) U11.20(PA6)
STATUS_LED_RED: Q2.1(B) U11.21(PA7)
STM32.PA15: R139.2 U11.51(PA15)
STM32_T_JTDI: J6.10 R139.1
STM32_T_NRST: C94.1 D21.C J6.12 JP18.2 U11.7(PG10-NRST)
STM32_T_SWCLK: J6.6 U11.50(PA14)
STM32_T_SWDIO: J6.4 U11.49(PA13)
STM32_T_SWO: J6.8 U11.56(PB3)
STM32_USART1_RX: J6.13 U11.23(PC5)
STM32_USART1_TX: J6.14 U11.22(PC4)
NetC90_2: C90.2 U11.5(PF0_-_OSC_IN) X3.1(X1)
NetC91_2: C91.2 U11.6(PF1_-_OSC_OUT) X3.3(X3)
NetC92_2: C92.2 U11.3(PC14_-_OSC32_IN) X2.1(X1)
NetC93_2: C93.2 U11.4(PC15_-_OSC32_OUT) X2.2(X2)

Not connected (* = marked no-connect by the designer): J6 1* 2* 9*; U10 3(SIO2)* 7(SIO3)*; U11 2(PC13)* 9(PC1)* 10(PC2)* 13(PA1)* 14(PA2)* 17(PA3)* 19(PA5)* 24(PB0)* 25(PB1)* 26(PB2)* 30(PB10)* 44(PA10)* 57(PB4)* 59(PB6)* 60(PB7)* 62(PB9)*

### Notes on the sheet
- SWD + JTAG Programing port
- Key
- SWDIO and SWCLK should run as a pair with equal length and shielded.
- SRAM
- Analog input to determine board model and revision.
  Place caps close to STM32 analog input.
- EXTERNAL lSE CLK 32.768KHz
- (near LED2) I_LED=(5V-2V-0.25)/390=7mA
- (near LED3) I_LED=(5V-2V-0.25)/390=7mA
- EXTERNAL HSE CLK 24MHz
- To reset uC, short JP18
- TITLE:
- NAME
- DATE
- PCA REVISION:
- PCA NAME:
- APPROVED BY:
- DESIGNED BY:
- PCA NUMBER:
- DATE:
- TIME:
- DOCUMENT SIZE:
- SHEET:
- OF
- B
- PROPRIETARY AND CONFIDENTIAL
  THIS DOCUMENT AND THE DATA CONTAINED HEREIN OR HEREWITH IS NOT TO BE REPRODUCED, USED, OR DISCLOSED, IN WHOLE OR IN PART, WITHOUT THE PERMISSION OF
  MYOMO, INC.
- (in symbol U_STM32G431R, part A) MCU_IOs; MCU CLK & RST

### Library data of the parts
C88 = C_0603_CER_1uF_50V_X7R: as C11 on sheet Regulators
C89 C94 = C_0402_CER_0.1uF_50V_X7R: as C38 on sheet Regulators
C90 C91 = C_0402_CER_6.8pF_50V_COG: CAP CER 6.8PF 50V C0G/NPO 0402; MFG: YAGEO; MFGPN: CC0402CRNPO9BN6R8; Myomo PN: 201-0015
C92 C93 = C_0402_CER_5.1pF_50V_COG: CAP CER 5.1PF 50V C0G/NPO 0402; MFG: YAGEO; MFGPN: CC0402CRNPO9BN5R1; Myomo PN: 201-0016
C112 C113 = C_0402_CER_47nF_50V_X7R: as C110 on sheet Regulators
D21 = D_TVS_6.1V_20W: TVS DIODE 3VRS ST 0201; MFG: STMicroelectronics; Myomo PN: 203-0007; MFGPN: ESDALC6V1-1U2
J6 = J_SAMTEC_FTSH-107-01-L-DV-K: CONN HEADER SMD 14POS 1.27MM; MFG: Samtec; Myomo PN: 211-0010; MFGPN: FTSH-107-01-L-DV-K; ComponentLink1Description: New link; ComponentLink1URL: *
JP17 JP18 = JP_1x2_TSW-102-07-F-S: as JP4 on sheet ADS1298; MFGPN: TSW-102-07-F-S
LED2 = D_LED_GREEN_LTST: as LED1 on sheet Regulators; Supplier 1: Digi-Key; Supplier Part Number 1: 160-1446-1-ND
LED3 = D_LED_RED_LTST: LED RED CLEAR SMD; Myomo PN: 203-0005; MFG: Lite-On Inc.; MFGPN: LTST-C191KRKT; Supplier 1: Digi-Key; Supplier Part Number 1: 160-1447-1-ND
Q1 Q2 = Q_NPN_PREBIAS_MMUN2211LT1G: TRANS PREBIAS NPN 246MW SOT23-3; MFG: ON Semiconductor; Myomo PN: 208-0001; Supplier 1: Digi-Key; MFGPN: MMUN2211LT1G; Supplier Part Number 1: MMUN2211LT1GOSCT-ND
R131 R132 = R_0603_390_1%_1/10W: RES 390 OHM 1% 1/10W 0603; MFG: YAGEO; MFGPN: RC0603FR-07390RL; Myomo PN: 200-0017
R138 = R_0402_100_1%_1/10W: as R152 on sheet Regulators
R139 = R_0402_47_1%_1/10W: RES SMD 47 OHM 1% 1/10W 0402; MFG: Panasonic; MFGPN: ERJ-2RKF47R0X; Myomo PN: 200-0020
R140 = R_0402_10K_1%_1/10W: as R28 on sheet Regulators
R144-R147 = R_0603_DNP: RES 0603 DNP
R154 R155 = R_0402_4.7K_1%_1/10W: as R149 on sheet Regulators
TP20-TP22 TP25 TP28-TP30 TP32 TP33 = TP_CLIP_BLK_5001: as TP7 on sheet Regulators; MFGPN: 5001
U10 = U_APS6404L-3SQR-SN: DRAM IoT RAM 64Mb QSPI (x1,x4) SDR 133/84MHz, RBX, 3V, Ind. Temp., SOP8; MFG: AP Memory; Myomo PN: 204-0011; MFGPN: APS6404L-3SQR-SN; Supplier 1: Mouser; Supplier Part Number 1: 878-APS6404L-3SQR-SN; ComponentLink1Description: schematics link; ComponentLink1URL: https://download.mikroe.com/documents/add-on-boards/click/DRAM_click/DRAM_click_v100_Schematic.PDF
U11 = U_STM32G431R: as U11 on sheet STM32_POWER; MFGPN: STM32G431RBT6
X2 = XTAL_32.768KHZ_20PPM: XTAL OSC 32.7680KHZ 6PF SMD; MFG: NDK; Myomo PN: 205-0002; MFGPN: MU00525-32.768K; Supplier 1: Digikey; Supplier Part Number 1: 644-MU00525-32.768KCT-ND
X3 = XTAL_24.0000MHZ_15PPM: XTAL OSC 24 MHz ±15ppm Crystal 6pF 80 Ohms 4-SMD, No Lead; MFG: NDK; Myomo PN: 205-0003; MFGPN: CS10820-24M; Supplier 1: Digikey; Supplier Part Number 1: 644-CS10820-24MCT-ND

## Nets that join several sheets
5V: Regulators (9 pins), Regulators_2 (FB1.1), CAN (C22.1 U2.3), STM32_IO (R131.1 R132.1)
AGND: Regulators_2 (8 pins), ADS1298 (18 pins), EMG_connectors_and_filters_CH_1_4 (21 pins), EMG_connectors_and_filters_CH_5_8 (16 pins)
AVDD_2V5: Regulators_2 (6 pins), ADS1298 (17 pins), EMG_connectors_and_filters_CH_1_4 (18 pins), EMG_connectors_and_filters_CH_5_8 (16 pins)
AVSS_2V5n: Regulators_2 (6 pins), ADS1298 (22 pins), EMG_connectors_and_filters_CH_1_4 (18 pins), EMG_connectors_and_filters_CH_5_8 (16 pins)
DVDD_3V3: Regulators (9 pins), ADS1298 (18 pins), CAN (C21.2 U2.5), STM32_POWER (15 pins), STM32_IO (C88.1 C89.1 J6.3 U10.8)
GND: Regulators (36 pins), Regulators_2 (20 pins), CAN (9 pins), STM32_POWER (15 pins), STM32_IO (18 pins)
STM32_AGND: STM32_POWER (8 pins), STM32_IO (C112.2 C113.2 R146.2 R147.2)
STM32_AVDD_3V3: STM32_POWER (6 pins), STM32_IO (R144.1 R145.1 R154.1 R155.1)
ADS1298_DRDYn: ADS1298 (R7.2 R137.2 TP34.TP), STM32_IO (U11.39)
ADS1298_RESETn: ADS1298 (R11.2 TP36.TP U1.36), STM32_IO (U11.40)
ADS1298_START: ADS1298 (R9.2 TP35.TP U1.38), STM32_IO (U11.58)
CAN_H: Regulators (J3.3), CAN (5 pins)
CAN_L: Regulators (J3.2), CAN (5 pins)
CH5_J2_R_n: EMG_connectors_and_filters_CH_1_4 (R26.2), EMG_connectors_and_filters_CH_5_8 (R92.1)
CH5_J2_R_p: EMG_connectors_and_filters_CH_1_4 (R74.2), EMG_connectors_and_filters_CH_5_8 (R75.1)
CH6_J2_R_n: EMG_connectors_and_filters_CH_1_4 (R24.2), EMG_connectors_and_filters_CH_5_8 (R112.1)
CH6_J2_R_p: EMG_connectors_and_filters_CH_1_4 (R25.2), EMG_connectors_and_filters_CH_5_8 (R102.1)
CH7_J2_R_n: EMG_connectors_and_filters_CH_1_4 (R22.2), EMG_connectors_and_filters_CH_5_8 (R95.1)
CH7_J2_R_p: EMG_connectors_and_filters_CH_1_4 (R23.2), EMG_connectors_and_filters_CH_5_8 (R78.1)
CH8_J2_R_n: EMG_connectors_and_filters_CH_1_4 (R20.2), EMG_connectors_and_filters_CH_5_8 (R115.1)
CH8_J2_R_p: EMG_connectors_and_filters_CH_1_4 (R21.2), EMG_connectors_and_filters_CH_5_8 (R105.1)
FDCAN1_RX: CAN (TP16.TP U2.4), STM32_IO (U11.45)
FDCAN1_TX: CAN (TP17.TP U2.1), STM32_IO (U11.46)
I2C3_SCL: Regulators (U13.5), STM32_IO (R154.2 TP32.TP U11.42)
I2C3_SDA: Regulators (U13.4), STM32_IO (R155.2 TP33.TP U11.41)
MCU_GPIO_CAN_STBY: CAN (R142.1), STM32_IO (U11.43)
PWR_MONITOR.ALERT: Regulators (R28.2 U13.3), STM32_IO (U11.11)
RLD_p: ADS1298 (5 pins), EMG_connectors_and_filters_CH_1_4 (C74.1 D20.3 R125.2)
SH_DRIVE_AMP: ADS1298 (R127.1 U9.1), EMG_connectors_and_filters_CH_1_4 (JP14.1)
SPI2_CSn: ADS1298 (R6.2 U1.39), STM32_IO (U11.38)
SPI2_MISO: ADS1298 (R136.2), STM32_IO (TP28.TP U11.36)
SPI2_MOSI: ADS1298 (R135.2), STM32_IO (TP29.TP U11.37)
SPI2_SCLK: ADS1298 (R134.2), STM32_IO (TP25.TP U11.35)
U1.IN1_n: ADS1298 (JP4.2 U1.15), EMG_connectors_and_filters_CH_1_4 (R35.1 R39.2 R43.1)
U1.IN1_p: ADS1298 (JP4.1 U1.16), EMG_connectors_and_filters_CH_1_4 (R14.1 R15.2 R33.1)
U1.IN2_n: ADS1298 (JP5.2 U1.13), EMG_connectors_and_filters_CH_1_4 (R55.1 R59.2 R63.1)
U1.IN2_p: ADS1298 (JP5.1 U1.14), EMG_connectors_and_filters_CH_1_4 (R45.1 R49.2 R53.1)
U1.IN3_n: ADS1298 (JP6.2 U1.11), EMG_connectors_and_filters_CH_1_4 (R36.1 R42.2 R44.1)
U1.IN3_p: ADS1298 (JP6.1 U1.12), EMG_connectors_and_filters_CH_1_4 (R16.1 R32.2 R34.1)
U1.IN4_n: ADS1298 (JP7.2 U1.9), EMG_connectors_and_filters_CH_1_4 (R56.1 R62.2 R64.1)
U1.IN4_p: ADS1298 (JP7.1 U1.10), EMG_connectors_and_filters_CH_1_4 (R46.1 R52.2 R54.1)
U1.IN5_n: ADS1298 (JP8.2 U1.7), EMG_connectors_and_filters_CH_5_8 (R89.1 R94.2 R98.1)
U1.IN5_p: ADS1298 (JP8.1 U1.8), EMG_connectors_and_filters_CH_5_8 (R72.1 R77.2 R83.1)
U1.IN6_n: ADS1298 (JP9.2 U1.5), EMG_connectors_and_filters_CH_5_8 (R110.1 R114.2 R118.1)
U1.IN6_p: ADS1298 (JP9.1 U1.6), EMG_connectors_and_filters_CH_5_8 (R100.1 R104.2 R108.1)
U1.IN7_n: ADS1298 (JP10.2 U1.3), EMG_connectors_and_filters_CH_5_8 (R90.1 R97.2 R99.1)
U1.IN7_p: ADS1298 (JP10.1 U1.4), EMG_connectors_and_filters_CH_5_8 (R73.1 R80.2 R84.1)
U1.IN8_n: ADS1298 (JP11.2 U1.1), EMG_connectors_and_filters_CH_5_8 (R111.1 R117.2 R119.1)
U1.IN8_p: ADS1298 (JP11.1 U1.2), EMG_connectors_and_filters_CH_5_8 (R101.1 R107.2 R109.1)

## Assembly variants
Variant of 110-0002_REV2: not fitted C4 C24 C25 C75 C76 R1 R2 R3 R4 R5 R7 R10 R13 R127 R128 R129 TP19 U9